# Altium project MOTION_BOARD.PrjPcb (part 1 of 2)
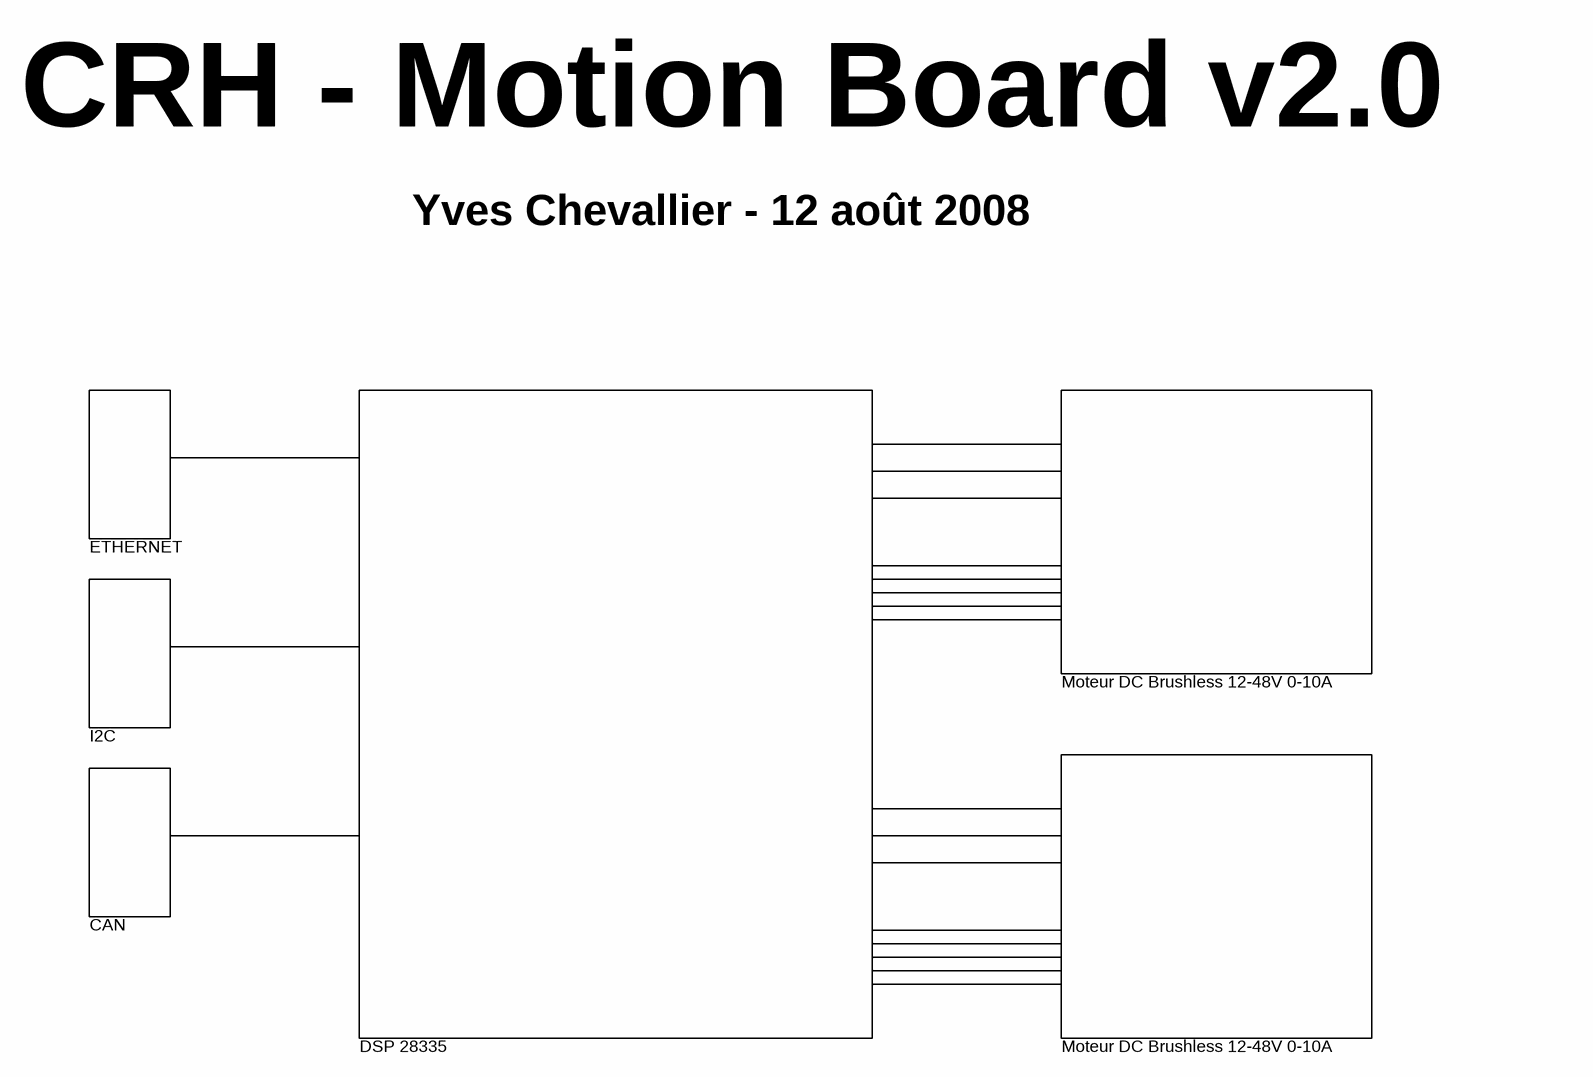
[diagram p0: Title.SchDoc]
Address4: +41 24 557 63 20; Address3: +41 24 557 73 77; Address2: CH-1400 Yverdon-les-Bains; Address1: HEIG-VD; SVN: Yes; ProjectTitle: CRH - MotionBoard
6 sheets, 321 parts. Net scope: hierarchical (ports join the sheet entries above them; power ports are global).
Board file: MOTION_BOARD.PcbDoc
Sheets:
  Title.SchDoc
  PowerSupply.SchDoc
  Interfaces.SchDoc
    DSP = DSP.SchDoc
      Centrale Inertielle = INERTIAL.SchDoc
    H-Bridge3 = PWM.SchDoc
    H-Bridge2 = PWM.SchDoc

## Sheet Title.SchDoc: CRH - Motionboard
size A3; ApprovedBy: Yves Chevallier; CheckedBy: Yves Chevallier; Author: Yves Chevallier; CompanyName: HEIG-VD; DrawnBy: Yves Chevallier; Engineer: Yves Chevallier; Organization: HEIG-VD; Address1: HEIG-VD; Address2: CH-1401 Yverdon-les-Bains; Address3: +41 21 557 73 77; Address4: +41 21 557 63 20; DocumentNumber: ABC.00.0000.000.0; Revision: v2.0; SheetTotal: 0; DrawnByDate: 2008-01-01; ExecutionWarrantDate: 2000-01-01; ExecutionWarrant: Yves Chevallier; Context: Robotique; PageSetup: Record=PageOptions|CenterHorizontal=True|CenterVertical=False|PrintScale=0.97|XCorrection=1.00|YCorrection=1.00|PrintKind=0|BorderSize=5000000|LeftOffset=0|BottomOffset=0|Orientation=2|PaperLength=1000|PaperWidth=1000|Scale=100|PaperSource=262|PrintQuality=600|MediaType=1|DitherType=10|PaperKind=A4|PrintScaleMode=1; EngineerDate: 2008-01-01; CheckedByDate: 2008-01-01; NoProject: 12; ProjectTitle: MotionBoard; SVN: Git; Version: 2.0.0; ProjectName: PRJ

### Notes on the sheet
- CRH - Motion Board v2.0
- Yves Chevallier - 12 août 2008
- ETHERNET
- Moteur DC Brushless 12-48V 0-10A
- I2C
- CAN
- DSP 28335
- HES-SO / HEIG-VD / TIN / IAI
  Route de Cheseaux, 1
  CH-1401 Yverdon-les-Bains
  T +41 24 557 73 77    F +41 24 557 63 20
  http://iai.heig-vd.ch
  iai@heig-vd.ch
- Title
- Size
- Date
- A4
- Project
- Sheet
- of
- No.
- Author
- SVN/Git
- Version
- File

## Sheet PowerSupply.SchDoc: Power Supplies
size A3; ApprovedBy: Yves Chevallier; CheckedBy: Yves Chevallier; Author: Yves Chevallier; CompanyName: HEIG-VD; DrawnBy: Yves Chevallier; Engineer: Yves Chevallier; Organization: HEIG-VD; Address1: HEIG-VD; Address2: CH-1400 Yverdon-les-Bains; Address3: +41 21 557 73 77; Address4: +41 24 557 63 20; DocumentNumber: ABC.00.0000.000.0; Revision: v2.0.0; SheetNumber: 1; SheetTotal: 6; DrawnByDate: 2008-01-01; ExecutionWarrantDate: 2008-01-01; ExecutionWarrant: Yves Chevallier; Context: CRH; PageSetup: Record=PageOptions|CenterHorizontal=True|CenterVertical=False|PrintScale=0.97|XCorrection=1.00|YCorrection=1.00|PrintKind=0|BorderSize=5000000|LeftOffset=0|BottomOffset=0|Orientation=2|PaperLength=1000|PaperWidth=1000|Scale=100|PaperSource=262|PrintQuality=600|MediaType=1|DitherType=10|PaperKind=A4|PrintScaleMode=1; EngineerDate: 2008 -01-01; CheckedByDate: 2008-01-01; ProjectName: PRJ
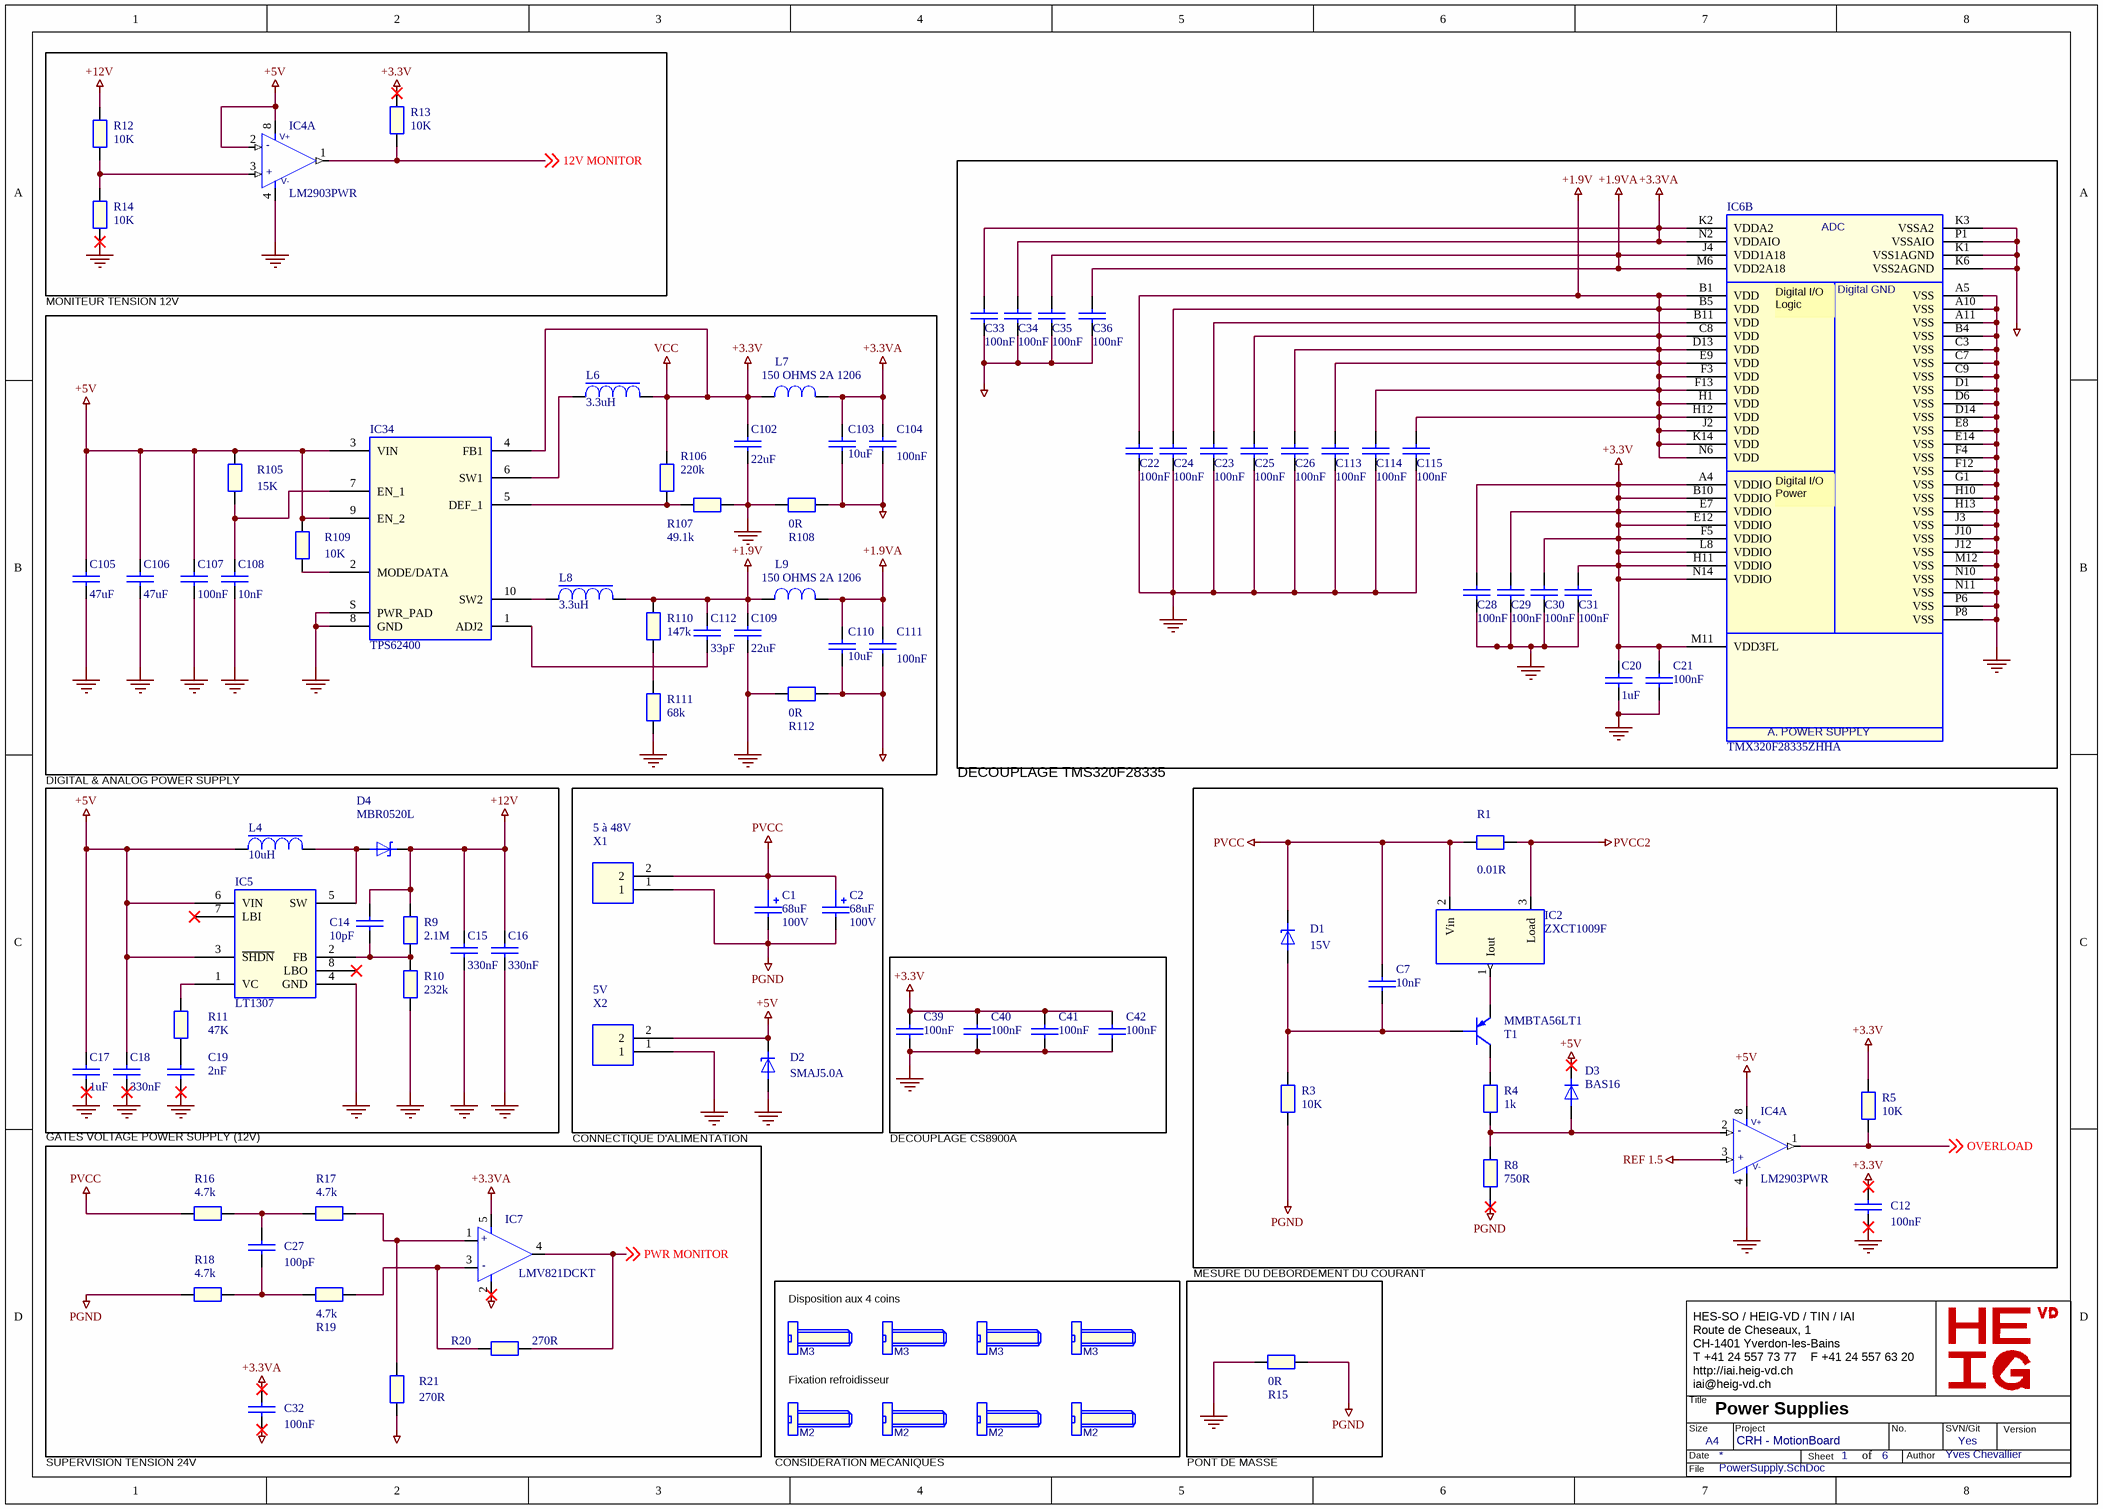
[diagram p1: PowerSupply.SchDoc]

### Parts
(Parts that share a designator on the sheet are numbered #1, #2 ... from top to bottom, then left to right.)
C1  68uF  Voltage: 100V  [SM/C_0805]
C2  68uF  Voltage: 100V  [SM/C_0805]
C7  10nF  [SM/C_0805]
C12  100nF  [SM/C_0805]
C14  10pF  [SM/C_0805]
C15  330nF  [SM/C_0805]
C16  330nF  [SM/C_0805]
C17  1uF  [SM/C_0805]
C18  330nF  [SM/C_0805]
C19  2nF  [SM/C_0805]
C20  1uF  [SM/C_0805]
C21  100nF  [SM/C_0805]
C22  100nF  [SM/C_0805]
C23  100nF  [SM/C_0805]
C24  100nF  [SM/C_0805]
C25  100nF  [SM/C_0805]
C26  100nF  [SM/C_0805]
C27  100pF  [SM/C_0805]
C28  100nF  [SM/C_0805]
C29  100nF  [SM/C_0805]
C30  100nF  [SM/C_0805]
C31  100nF  [SM/C_0805]
C32  100nF  [SM/C_0805]
C33  100nF  [SM/C_0805]
C34  100nF  [SM/C_0805]
C35  100nF  [SM/C_0805]
C36  100nF  [SM/C_0805]
C39  100nF  [SM/C_0805]
C40  100nF  [SM/C_0805]
C41  100nF  [SM/C_0805]
C42  100nF  [SM/C_0805]
C102  22uF  [SM/C_0805]
C103  10uF  [SM/C_0805]
C104  100nF  [SM/C_0805]
C105  47uF  [SM/C_0805]
C106  47uF  [SM/C_0805]
C107  100nF  [SM/C_0805]
C108  10nF  [SM/C_0805]
C109  22uF  [SM/C_0805]
C110  10uF  [SM/C_0805]
C111  100nF  [SM/C_0805]
C112  33pF  [SM/C_0805]
C113  100nF  [SM/C_0805]
C114  100nF  [SM/C_0805]
C115  100nF  [SM/C_0805]
D1  15V  [HEIG/SM/SOT23]
D2  SMAJ5.0A  [SM/DO214AA_12]
D3  BAS16  [HEIG/SM/SOT23]
D4  MBR0520L  [HEIG/SM/SOD123]
H1  M3  [M3]  (value not drawn)
H2  M3  [M3]  (value not drawn)
H3  M3  [M3]  (value not drawn)
H4  M3  [M3]  (value not drawn)
H5  M2  [M3]  (value not drawn)
H6  M2  [M3]  (value not drawn)
H7  M2  [M3]  (value not drawn)
H8  M2  [M3]  (value not drawn)
IC2  ZXCT1009F  [HEIG/SM/SOT23]
IC4#1  LM2903PWR  [HEIG/SM/TSSOP8]  (part A of 2)
IC4#2  LM2903PWR  [HEIG/SM/TSSOP8]  (part A of 2)
IC5  LT1307  [HEIG/SM/SOIC8]
IC6  TMX320F28335ZHHA  [HEIG/BGA/MICROSTAR/S-PBGA-N179]  (part B of 2)
IC7  LMV821DCKT  [HEIG/SM/SC70]
IC34  TPS62400  [HEIG/TI/S-PVSON-N10]
L4  10uH  [HEIG/SM/L_2520]
L6  3.3uH  [HEIG/COILS/VLF4012A]
L7  150 OHMS 2A 1206  [SM/L_1206]
L8  3.3uH  [HEIG/COILS/VLF4012A]
L9  150 OHMS 2A 1206  [SM/L_1206]
R1  0.01R  [R400]
R3  10K  [R400]
R4  1k  [R400]
R5  10K  [R400]
R8  750R  [R400]
R9  2.1M  [SM/R_0805]
R10  232k  [SM/R_0805]
R11  47K  [SM/R_0805]
R12  10K  [R400]
R13  10K  [R400]
R14  10K  [R400]
R15  0R  [SM/R_0805]
R16  4.7k  [R400]
R17  4.7k  [R400]
R18  4.7k  [R400]
R19  4.7k  [R400]
R20  270R  [R400]
R21  270R  [R400]
R105  15K  [SM/R_0805]
R106  220k  [SM/R_0805]
R107  49.1k  [SM/R_0805]
R108  0R  [SM/R_0805]
R109  10K  [SM/R_0805]
R110  147k  [SM/R_0805]
R111  68k  [SM/R_0805]
R112  0R  [SM/R_0805]
T1  MMBTA56LT1  [HEIG/SM/SOT23]
X1  5 à 48V  [HEIG/PHOENIX/MC 2.5/ 2-G-5.08]
X2  5V  [HEIG/PHOENIX/MC 1,5/ 2-G-3,81]

### Blocks framed on the sheet
MONITEUR TENSION 12V: C102-C112 IC34 L6-L9 R105-R112
DIGITAL & ANALOG POWER SUPPLY: C14-C19 D4 IC5 L4 R9-R11
MESURE DU DEBORDEMENT DU COURANT: R15

### Nets
+1.9V: C22.1 C24.1 C25.1 C26.1 C109.1 C112.1 C113.1 C114.1 C115.1 IC6.B1(VDD) IC6.B5(VDD) IC6.C8(VDD) IC6.D13(VDD) IC6.E9(VDD) IC6.F3(VDD) IC6.F13(VDD) IC6.H1(VDD) IC6.H12(VDD) IC6.J2(VDD) IC6.K14(VDD) IC6.N6(VDD) L8.2 L9.1 R110.2
+1.9VA: C35.1 C36.1 C110.1 C111.1 IC6.J4(VDD1A18) IC6.M6(VDD2A18) L9.2
+3.3V: C12.2 C20.1 C21.1 C28.1 C29.1 C30.1 C31.1 C39.1 C40.1 C41.1 C42.1 C102.1 IC6.A4(VDDIO) IC6.B10(VDDIO) IC6.E7(VDDIO) IC6.E12(VDDIO) IC6.F5(VDDIO) IC6.H11(VDDIO) IC6.L8(VDDIO) IC6.M11(VDD3FL) IC6.N14(VDDIO) IC34.4(FB1) L6.2 L7.1 R5.1 R13.1 R106.2  [also labelled VCC]
+3.3VA: C32.2 C33.1 C34.1 C103.1 C104.1 IC6.K2(VDDA2) IC6.N2(VDDAIO) IC7.5(VCC) L7.2
+5V: C17.1 C18.1 C105.1 C106.1 C107.1 D2.1 D3.3(k) IC4#1.2(IN-) IC4#1.8(VCC) IC4#2.8(VCC) IC5.3(~{SHDN}) IC5.6(VIN) IC34.3(VIN) IC34.9(EN_2) L4.1 R105.2 R109.2 X2.2
+12V: C14.1 C15.1 C16.1 D4.2(k) R9.2 R12.1
AGND: C32.1 C33.2 C34.2 C35.2 C36.2 C103.2 C104.2 C110.2 C111.2 IC6.K1(VSS1AGND) IC6.K3(VSSA2) IC6.K6(VSS2AGND) IC6.P1(VSSAIO) IC7.2(GND) R21.1 R108.2 R112.2
GND: C12.1 C15.2 C16.2 C17.2 C18.2 C19.2 C20.2 C21.2 C22.2 C23.2 C24.2 C25.2 C26.2 C28.2 C29.2 C30.2 C31.2 C39.2 C40.2 C41.2 C42.2 C102.2 C105.2 C106.2 C107.2 C108.2 C109.2 C113.2 C114.2 C115.2 D2.2 IC4#1.4(GND) IC4#2.4(GND) IC5.4(GND) IC6.A5(VSS) IC6.A10(VSS) IC6.A11(VSS) IC6.B4(VSS) IC6.C3(VSS) IC6.C7(VSS) IC6.C9(VSS) IC6.D1(VSS) IC6.D6(VSS) IC6.D14(VSS) IC6.E8(VSS) IC6.E14(VSS) IC6.F4(VSS) IC6.F12(VSS) IC6.G1(VSS) IC6.H10(VSS) IC6.H13(VSS) IC6.J3(VSS) IC6.J10(VSS) IC6.J12(VSS) IC6.M12(VSS) IC6.N10(VSS) IC6.N11(VSS) IC6.P6(VSS) IC6.P8(VSS) IC34.8(GND) IC34.S(PWR_PAD) R10.1 R14.2 R15.1 R107.2 R108.1 R111.1 R112.1 X2.1
PGND: C1.2 C2.2 R3.2 R8.2 R15.2 R18.1 X1.1
PVCC: C1.1 C2.1 C7.1 D1.3(k) IC2.2(Vin) R1.1 R16.1 X1.2
PVCC2: IC2.3(Load) R1.2
REF 1.5: IC4#2.3(IN+)
12V MONITOR: IC4#1.1(out) R13.2 ; off-sheet 12V MONITOR
OVERLOAD: IC4#2.1(out) R5.2 ; off-sheet OVERLOAD
PWR MONITOR: IC7.4(out) R20.2 ; off-sheet PWR MONITOR
NetC7_2: C7.2 D1.1(a) R3.1 T1.1(B)
NetC14_2: C14.2 IC5.2(FB) R9.1 R10.2
NetC19_1: C19.1 R11.1
NetC23_1: C23.1 IC6.B11(VDD)
NetC27_1: C27.1 R18.2 R19.1
NetC27_2: C27.2 R16.2 R17.1
NetC108_1: C108.1 IC34.7(EN_1) R105.1
NetC112_2: C112.2 IC34.1(ADJ2)
NetD3_1: D3.1(a) IC4#2.2(IN-) R4.2 R8.1
NetD4_1: D4.1(a) IC5.5(SW) L4.2
NetIC2_1: IC2.1(Iout) T1.2(E)
NetIC4#1_3: IC4#1.3(IN+) R12.2 R14.1
NetIC5_1: IC5.1(VC) R11.2
NetIC7_1: IC7.1(IN+) R17.2 R21.2
NetIC7_3: IC7.3(IN-) R19.2 R20.1
NetIC34_2: IC34.2(MODE/DATA) R109.1
NetIC34_5: IC34.5(DEF_1) R106.1 R107.1
NetIC34_6: IC34.6(SW1) L6.1
NetIC34_10: IC34.10(SW2) L8.1
NetR4_1: R4.1 T1.3(C)
NetR110_1: R110.1 R111.2

Not connected (* = marked no-connect by the designer): H1 1(EARTH); H2 1(EARTH); H3 1(EARTH); H4 1(EARTH); H5 1(EARTH); H6 1(EARTH); H7 1(EARTH); H8 1(EARTH); IC5 7(LBI)* 8(LBO)*

### Notes on the sheet
- DECOUPLAGE TMS320F28335
- GATES VOLTAGE POWER SUPPLY (12V)
- CONNECTIQUE D'ALIMENTATION
- DECOUPLAGE CS8900A
- Disposition aux 4 coins
- Fixation refroidisseur
- SUPERVISION TENSION 24V
- CONSIDERATION MECANIQUES
- PONT DE MASSE
- HES-SO / HEIG-VD / TIN / IAI
  Route de Cheseaux, 1
  CH-1401 Yverdon-les-Bains
  T +41 24 557 73 77    F +41 24 557 63 20
  http://iai.heig-vd.ch
  iai@heig-vd.ch
- Title
- Size
- Date
- A4
- Project
- Sheet
- of
- No.
- Author
- SVN/Git
- Version
- File
- (in symbol LM2903, part A) V+; -; +; V-
- (in symbol LMV821DCKT_0) +; -
- (in symbol TMS320F2833xZHH, part B) ADC; Digital GND; Digital I/O / Logic; Digital I/O / Power; A. POWER SUPPLY

### Library data of the parts
C1 C2 = C+: Quantité min: 1; Fabricant: PANASONIC; Prix: 2.80; Ref. Fabricant: EEVFK2A680Q; Ref. Fab: ECA1CM471.PANASONIC; PCB Footprint: HEIG/SM/CT_H13; Ref. Distributeur: 9696156; Distributeur: Farnell; Price in €: 0.20; Ref. Distributor: 320-1508; Distributor: Farnell
C7 = C: Quantité min: 5; Prix: 0.16; Ref. Fabricant: 06031C103K4Z2A; Fabricant: AVX; Tolerance: 5%; Voltage: 50V; PCB Footprint: HEIG/SM/C_0603; Distributeur: Farnell; Ref. Distributeur: 1301715; Price: 0.07; Price in €: 0.07
C12 = C: Quantité min: 10; Ref. Fabricant: 2238 786 15649; Fabricant: PHYCOMP; Prix: 0.113; Voltage: 16V; Tolerance: 10%; PCB Footprint: HEIG/SM/C_0603; Ref. Distributeur: 432210; Distributeur: Farnell; Price: 0.04
C14 = C_Dup1: Ref. Fabricant: 06035A100JAT2A; Prix: 0.066; Ref. Fab: AVXMCCTA106M006.MULTICOMP; VOLTAGE: 10V; Référence: 757-720; Prix Unitaire: 0.40; Fabricant: AVX; Quantité min: 10; PCB Footprint: HEIG/SM/C_0603; Ref. Distributeur: 499110; Distributeur: Farnell; Price in €: 0.87; Ref. Distributor: 967-014; Distributor: Farnell
C15 C16 = C_Dup1: Ref. Fabricant: B37941K0334K60; Prix: 0.123; Ref. Fab: AVXMCCTA106M006.MULTICOMP; VOLTAGE: 25V; Référence: 757-720; Prix Unitaire: 0.40; Fabricant: EPCOS; Quantité min: 10; Tolérance: 10%; Ref. Distributeur: 8805660; Distributeur: Farnell; Price in €: 0.87; Ref. Distributor: 967-014; Distributor: Farnell; PCB Footprint: SM/C_0805
C17 C20 = C_Dup1: Prix Unitaire: 0.40; Référence: 757-720; VOLTAGE: 10V; Ref. Fab: AVXMCCTA106M006.MULTICOMP; Prix: 0.221; Ref. Fabricant: 06036D105KAT2A; Fabricant: AVX; Quantité min: 10; Tolérance: 10%; PCB Footprint: HEIG/SM/C_0603; Distributor: Farnell; Ref. Distributor: 967-014; Price in €: 0.87; Distributeur: Farnell; Ref. Distributeur: 1327676
C18 = C_Dup1: Ref. Fabricant: 0603YD334KAT2A; Prix: 0.382; Ref. Fab: AVXMCCTA106M006.MULTICOMP; VOLTAGE: 16V; Référence: 757-720; Prix Unitaire: 0.40; Fabricant: MULTICOMP; Tolérance: 10%; Quantité min: 10; PCB Footprint: HEIG/SM/C_0603; Ref. Distributeur: 1327681; Distributeur: Farnell; Price in €: 0.87; Ref. Distributor: 967-014; Distributor: Farnell
C19 = C_Dup1: Ref. Fabricant: 06035C222KAT2A; Prix: 0.098; Ref. Fab: AVXMCCTA106M006.MULTICOMP; VOLTAGE: 10V; Référence: 757-720; Prix Unitaire: 0.40; Fabricant: AVX; Quantité min: 10; Tolérance: 10%; PCB Footprint: HEIG/SM/C_0603; Ref. Distributeur: 498592; Distributeur: Farnell; Price in €: 0.87; Ref. Distributor: 967-014; Distributor: Farnell
C21 = C_Dup1: Quantité min: 10; Fabricant: PHYCOMP; Ref. Fabricant: 2238 786 15649; Prix: 0.113; Ref. Fab: AVX; Voltage: 16V; PCB Footprint: HEIG/SM/C_0603; Distributeur: Farnell; Ref. Distributeur: 432210; Distributor: Farnell; Price in €: 0.140; Ref. Distributor: 499-687
C22 C23 C25 C26 C33 C113-C115 = C_Dup1: Référence: 499-687; Prix Unitaire: 0.14; Ref. Fab: AVX; Prix: 0.113; Ref. Fabricant: 2238 786 15649; Fabricant: PHYCOMP; Quantité min: 10; Voltage: 16V; PCB Footprint: HEIG/SM/C_0402; Distributor: Farnell; Ref. Distributor: 499-687; Price in €: 0.140; Distributeur: Farnell
C24 = C_Dup1: Voltage: 16V; Ref. Fabricant: 2238 786 15649; Prix: 0.113; Ref. Fab: AVX; Prix Unitaire: 0.14; Référence: 499-687; Fabricant: PHYCOMP; Quantité min: 10; PCB Footprint: HEIG/SM/C_0402; Distributeur: Farnell; Price in €: 0.140; Ref. Distributor: 499-687; Distributor: Farnell
C27 = C_Dup1: Quantité min: 10; Fabricant: MURATA; Ref. Fab: AVX; Prix Unitaire: 0.14; Référence: 499-687; Prix: 0.071; Ref. Fabricant: GRM1885C1H101JA01D; PCB Footprint: HEIG/SM/C_0603; Price in €: 0.140; Ref. Distributor: 499-687; Distributor: Farnell; Distributeur: Farnell; Ref. Distributeur: 8819866
C28 = C_Dup1: Voltage: 16V; Quantité min: 10; Fabricant: PHYCOMP; Ref. Fabricant: 2238 786 15649; Prix: 0.113; Ref. Fab: AVX; Référence: 499-687; Prix Unitaire: 0.14; PCB Footprint: HEIG/SM/C_0402; Distributeur: Farnell; Price in €: 0.140; Ref. Distributor: 499-687; Distributor: Farnell
C29 C30 = C_Dup1: Prix Unitaire: 0.14; Référence: 499-687; Ref. Fab: AVX; Prix: 0.113; Ref. Fabricant: 2238 786 15649; Fabricant: PHYCOMP; Quantité min: 10; Voltage: 16V; PCB Footprint: HEIG/SM/C_0402; Distributor: Farnell; Ref. Distributor: 499-687; Price in €: 0.140; Distributeur: Farnell
C31 = C_Dup1: Quantité min: 10; Fabricant: PHYCOMP; Ref. Fabricant: 2238 786 15649; Prix: 0.113; Ref. Fab: AVX; Référence: 499-687; Prix Unitaire: 0.14; Voltage: 16V; PCB Footprint: HEIG/SM/C_0402; Distributeur: Farnell; Price in €: 0.140; Ref. Distributor: 499-687; Distributor: Farnell
C32 = C_Dup1: Voltage: 16V; Quantité min: 10; Fabricant: PHYCOMP; Ref. Fabricant: 2238 786 15649; Prix: 0.113; Référence: 499-687; Prix Unitaire: 0.14; Ref. Fab: AVX; PCB Footprint: HEIG/SM/C_0603; Ref. Distributeur: 432210; Distributeur: Farnell; Distributor: Farnell; Ref. Distributor: 499-687; Price in €: 0.140
C34 = C_Dup1: Voltage: 16V; Quantité min: 10; Fabricant: PHYCOMP; Ref. Fabricant: 2238 786 15649; Prix: 0.113; Ref. Fab: AVX; Prix Unitaire: 0.14; Référence: 499-687; PCB Footprint: HEIG/SM/C_0402; Distributeur: Farnell; Price in €: 0.140; Ref. Distributor: 499-687; Distributor: Farnell
C35 = C_Dup1: Ref. Fab: AVX; Prix Unitaire: 0.14; Référence: 499-687; Prix: 0.113; Ref. Fabricant: 2238 786 15649; Fabricant: PHYCOMP; Quantité min: 10; Voltage: 16V; PCB Footprint: HEIG/SM/C_0402; Price in €: 0.140; Ref. Distributor: 499-687; Distributor: Farnell; Distributeur: Farnell
C36 = C_Dup1: Voltage: 16V; Quantité min: 10; Fabricant: PHYCOMP; Ref. Fabricant: 2238 786 15649; Prix: 0.113; Référence: 499-687; Prix Unitaire: 0.14; Ref. Fab: AVX; PCB Footprint: HEIG/SM/C_0402; Distributeur: Farnell; Distributor: Farnell; Ref. Distributor: 499-687; Price in €: 0.140
C39 C40 = C_Dup1: PCB Footprint: HEIG/SM/C_0603; Voltage: 16V; Quantité min: 10; Fabricant: PHYCOMP; Ref. Fabricant: 2238 786 15649; Prix: 0.113; Ref. Fab: AVX; Référence: 499-687; Prix Unitaire: 0.14; Ref. Distributeur: 432210; Distributeur: Farnell; Price in €: 0.140; Ref. Distributor: 499-687; Distributor: Farnell
C41 C42 = C_Dup1: PCB Footprint: HEIG/SM/C_0603; Voltage: 16V; Prix Unitaire: 0.14; Référence: 499-687; Ref. Fab: AVX; Prix: 0.113; Ref. Fabricant: 2238 786 15649; Fabricant: PHYCOMP; Quantité min: 10; Distributor: Farnell; Ref. Distributor: 499-687; Price in €: 0.140; Distributeur: Farnell; Ref. Distributeur: 432210
C102 = C_Dup1: PCB Footprint: HEIG/SM/C_1206; Ref. Fabricant: C1206C226K9PAC; Prix: 1.15; Prix Unitaire: 0.40; Référence: 757-720; VOLTAGE: 6.3V; Ref. Fab: AVXMCCTA106M006.MULTICOMP; Fabricant: AVX; Quantité min: 1; Distributeur: Farnell; Ref. Distributeur: 1288265; Distributor: Farnell; Ref. Distributor: 967-014; Price in €: 0.87
C103 = C_Dup1: PCB Footprint: HEIG/SM/C_0805; Ref. Fabricant: C0805C106K9PAC; Prix: 0.55; Ref. Fab: AVXMCCTA106M006.MULTICOMP; VOLTAGE: 6.3V; Référence: 757-720; Prix Unitaire: 0.40; Fabricant: KEMET; Quantité min: 10; Ref. Distributeur: 9227814; Distributeur: Farnell; Price in €: 0.87; Ref. Distributor: 967-014; Distributor: Farnell
C104 C111 = C_Dup1: Quantité min: 10; Voltage: 16V; Fabricant: PHYCOMP; Ref. Fabricant: 2238 786 15649; Prix: 0.113; Référence: 499-687; Prix Unitaire: 0.14; Ref. Fab: AVX; PCB Footprint: HEIG/SM/C_0603; Ref. Distributeur: 432210; Distributeur: Farnell; Distributor: Farnell; Ref. Distributor: 499-687; Price in €: 0.140
C105 C106 = C_Dup1: PCB Footprint: HEIG/SM/C_1206; Prix Unitaire: 0.40; Référence: 757-720; VOLTAGE: 6.3V; Ref. Fab: AVXMCCTA106M006.MULTICOMP; Prix: 8.20; Ref. Fabricant: 12106D476MAT2A; Fabricant: AVX; Quantité min: 1; Distributor: Farnell; Ref. Distributor: 967-014; Price in €: 0.87; Distributeur: Farnell; Ref. Distributeur: 1327743
C107 C108 C112 = C_Dup1: PCB Footprint: HEIG/SM/C_0603; Prix Unitaire: 0.40; Référence: 757-720; VOLTAGE: 10V; Ref. Fab: AVXMCCTA106M006.MULTICOMP; Quantité min: 1; Distributor: Farnell; Ref. Distributor: 967-014; Price in €: 0.87; Distributeur: Farnell
C109 = C_Dup1: PCB Footprint: HEIG/SM/C_1206; Prix Unitaire: 0.40; Référence: 757-720; VOLTAGE: 6.3V; Ref. Fab: AVXMCCTA106M006.MULTICOMP; Prix: 1.15; Ref. Fabricant: C1206C226K9PAC; Fabricant: AVX; Quantité min: 1; Distributor: Farnell; Ref. Distributor: 967-014; Price in €: 0.87; Distributeur: Farnell; Ref. Distributeur: 1288265
C110 = C_Dup1: PCB Footprint: HEIG/SM/C_0805; Ref. Fab: AVXMCCTA106M006.MULTICOMP; VOLTAGE: 6.3V; Référence: 757-720; Prix Unitaire: 0.40; Prix: 0.55; Ref. Fabricant: C0805C106K9PAC; Fabricant: KEMET; Quantité min: 10; Price in €: 0.87; Ref. Distributor: 967-014; Distributor: Farnell; Distributeur: Farnell; Ref. Distributeur: 9227814
D1 = D Zener_1: Fabricant: MULTICOMP; Ref. Fabricant: BZX84C15; Prix: 0.167; Quantité min: 5; Price: 0.19; Distributeur: Farnell; Ref. Distributeur: 1466585; Voltage: BZX84C15; PCB Footprint: HEIG/SM/SOT23
D2 = D Zener_0: Quantité min: 1; Fabricant: VISHAY GENERAL SEMICONDUCTOR; Prix: 0.989; Distributeur: Farnell; Ref. Distributeur: 9550941; Ref. Fabricant: SMAJ5.0A; Distributor: Farnell; PCB Footprint: SM/DO214AA_12
D3 = D_0: Fabricant: NXP; Prix: 0.196; Quantité min: 10; Price: 0.19; Ref. Distributeur: 1081180; Distributeur: Farnell; Ref. Fabricant: BAS16; PCB Footprint: HEIG/SM/SOT23
D4 = D Schottky: Quantité min: 1; Prix: 0.12; Fabricant: FAIRCHILD SEMICONDUCTOR; Ref. Fabricant: MBR0520L; Ref. Distributeur: 1467521; Distributeur: Farnell; PCB Footprint: HEIG/SM/SOD123
H1-H4 = M3: PCB Footprint: HEIG/HOLE/M3
H5-H8 = M3_0: PCB Footprint: HEIG/HOLE/M2; Price in €: 0.60; Ref. Distributor: 34 11 30; Distributor: Distrelec; Ref. Fab: -
IC2 = ZXCT1009: Quantité min: 1; Prix: 2.90; Fabricant: ZETEX; Ref. Fabricant: ZXCT1009F; Distributeur: Farnell; Ref. Distributeur: 1132757; Price: 2.3; PCB Footprint: HEIG/SM/SOT23
IC4#1 IC4#2 = LM2903: Quantité min: 1; Prix: 0.554; Fabricant: TEXAS INSTRUMENTS; Ref. Fabricant: LM2903PWR; Distributeur: Farnell; Ref. Distributeur: 8389209; Price: 0.56; PCB Footprint: HEIG/SM/TSSOP8
IC5 = LT1307: Ref. Fabricant: LT1307BCS8#PBF; Prix: 8.70; Quantité min: 1; Fabricant: LINEAR TECHNOLOGY; Distributeur: Farnell; Ref. Distributeur: 1273725; PCB Footprint: HEIG/SM/SOIC8
IC6 = TMS320F2833xZHH: Fabricant: TEXAS INSTRUMENTS; Prix: 94.45; Quantité min: 1; Distributeur: Farnell; Ref. Distributeur: 1503814; Ref. Fabricant: TMX320F28335ZHHA; PCB Footprint: HEIG/BGA/MICROSTAR/S-PBGA-N179
IC7 = LMV821DCKT_0: Quantité min: 1; Fabricant: TEXAS INSTRUMENTS; Prix: 1.45; Ref. Fabricant: LMV821IDCKTE4; PCB Footprint: HEIG/SM/SC70; Distributor: Spoerle; Ref. Fab: LMV821DCKT; Ref. Distributor: LMV821DCKT; Price in €: 0.7; Ref. Distributeur: 1053752; Distributeur: Farnell
IC34 = TPS62400_1: PCB Footprint: HEIG/TI/S-PVSON-N10
L4 = L Noyau: Ref. Fabricant: ELJFC100JF; Prix: 1; Quantité min: 5; Tolérance: 5%; Fabricant: PANASONIC; Distributeur: Farnell; Ref. Distributeur: 1198424; PCB Footprint: HEIG/SM/L_2520
L6 L8 = L Noyau: Quantité min: 1; Fabricant: TDK; Ref. Fabricant: VLF4012AT-3R3M1R3; Prix: 3.90; PCB Footprint: HEIG/COILS/VLF4012A; Distributeur: Farnell; Ref. Distributeur: 1301686
L7 = L Symbole 3 spires: Ref. Fab: epocs; Prix: 0.552; Ref. Fabricant: MLB-321611-0150PN; Fabricant: KITAGAWA; Quantité min: 10; Distributor: Farnell; Price in €: 0.98; Ref. Distributor: 200-610; Ref. Distributeur: 1308791; Distributeur: Farnell; PCB Footprint: SM/L_1206
L9 = L Symbole 3 spires: Quantité min: 10; Fabricant: KITAGAWA; Ref. Fabricant: MLB-321611-0150PN; Prix: 0.552; Ref. Fab: epocs; Distributeur: Farnell; Ref. Distributeur: 1308791; Distributor: Farnell; Price in €: 0.98; Ref. Distributor: 200-610; PCB Footprint: SM/L_1206
R1 = R_Dup1: Quantité min: 5; Fabricant: VISHAY DALE; Ref. Fabricant: WSR-5 .01 1% EA E2; Prix: 4.20; PCB Footprint: WSR-5; Distributeur: Farnell; Ref. Distributeur: 1107476
R3 = R_Dup1: Quantité min: 50; Ref. Fabricant: 232270260103; Fabricant: PHYCOMP; Prix: 0.113; Tolerance: 5%; Power: 0.063W; PCB Footprint: HEIG/SM/R_0603; Ref. Distributeur: 9233504; Distributeur: Farnell; Price: 0.06
R4 = R_Dup1: Quantité min: 50; Ref. Fabricant: 232270260102; Fabricant: PHYCOMP; Prix: 0.113; Tolerance: 1%; Power: 0.063W; PCB Footprint: HEIG/SM/R_0603; Ref. Distributeur: 9233385; Distributeur: Farnell; Price: 0.06
R5 = R_Dup1: Quantité min: 50; Ref. Fabricant: 232270260103; Fabricant: PHYCOMP; Prix: 0.113; Power: 0.063W; Tolerance: 5%; PCB Footprint: HEIG/SM/R_0603; Ref. Distributeur: 9233504; Distributeur: Farnell; Price: 0.06
R8 = R_Dup1: Quantité min: 50; Ref. Fabricant: MC 0.063W 0603 1% 750R; Fabricant: MULTICOMP; Prix: 0.064; Tolerance: 1%; Power: 0.063W; PCB Footprint: HEIG/SM/R_0603; Ref. Distributeur: 9331506; Distributeur: Farnell; Price: 0.06
R9 = R SMD 0805N: Prix: 0.01; Ref. Fabricant: CRCW06032M10FKEA; Fabricant: VISHAY DALE; Quantité min: 10; PCB Footprint: HEIG/SM/R_0603; Package: SMD 0805N; Ref. Distributeur: 1570725; Distributeur: Farnell
R10 = R SMD 0805N: Ref. Fabricant: CPF0603F232KC1; Prix: 0.79; Fabricant: TYCO ELECTRONICS; Quantité min: 5; Tolérance: 1%; PCB Footprint: HEIG/SM/R_0603; Package: SMD 0805N; Distributeur: Farnell; Ref. Distributeur: 1527729
R11 = R SMD 0805N: Prix: 0.056; Ref. Fabricant: 232270260473; Fabricant: PHYCOMP; Quantité min: 50; PCB Footprint: HEIG/SM/R_0603; Package: SMD 0805N; Ref. Distributeur: 9233580; Distributeur: Farnell
R12 = R_Dup1: Quantité min: 50; Ref. Fabricant: 232270260103; Fabricant: PHYCOMP; Prix: 0.113; Tolerance: 1%; Power: 0.063W; PCB Footprint: HEIG/SM/R_0603; Ref. Distributeur: 9233504; Distributeur: Farnell; Price: 0.06
R13 = R_Dup1: Quantité min: 50; Prix: 0.113; Ref. Fabricant: 232270260103; Fabricant: PHYCOMP; Power: 0.063W; Tolerance: 5%; PCB Footprint: HEIG/SM/R_0603; Distributeur: Farnell; Ref. Distributeur: 9233504; Price: 0.06
R14 = R_Dup1: Quantité min: 50; Prix: 0.113; Ref. Fabricant: 232270260103; Fabricant: PHYCOMP; Tolerance: 1%; Power: 0.063W; PCB Footprint: HEIG/SM/R_0603; Ref. Distributeur: 9233504; Distributeur: Farnell; Price: 0.06
R15 = R SMD 0805N: Quantité min: 50; Fabricant: MULTICOMP; Ref. Fabricant: MC 0.125W 1206 0R; Prix: 0.064; PCB Footprint: SM/R_1206; Package: SMD 0805N; Distributeur: Farnell; Ref. Distributeur: 9336974
R16-R19 = R_Dup1: Quantité min: 50; Fabricant: MULTICOMP; Prix: 0.064; Ref. Fabricant: MC 0.063W 0603 5% 4K7; PCB Footprint: HEIG/SM/R_0603; Distributeur: Farnell; Ref. Distributeur: 9332154
R20 R21 = R_Dup1: Prix: 0.064; Ref. Fabricant: MC 0.063W 0603 5% 270R; Fabricant: MULTICOMP; Quantité min: 50; PCB Footprint: HEIG/SM/R_0603; Distributeur: Farnell
R105 = R SMD 0805N: PCB Footprint: SM/R_0603; Prix: 0.064; Quantité min: 50; Package: SMD 0805N; Distributeur: Farnell
R106 R107 = R SMD 0805N: PCB Footprint: SM/R_0603; Quantité min: 50; Prix: 0.064; Package: SMD 0805N; Distributeur: Farnell
R108 = R SMD 0805N: Quantité min: 50; Fabricant: MULTICOMP; Prix: 0.064; Package: SMD 0805N; PCB Footprint: SM/R_0805; Distributeur: Farnell
R109 = R SMD 0805N: Prix: 0.064; Quantité min: 50; PCB Footprint: SM/R_0603; Package: SMD 0805N; Distributeur: Farnell
R110 = R SMD 0805N: PCB Footprint: SM/R_0603; Prix: 0.064; Ref. Fabricant: MC 0.063W 0603 1% 147K; Fabricant: MULTICOMP; Quantité min: 50; Package: SMD 0805N; Distributeur: Farnell; Ref. Distributeur: 1171002
R111 = R SMD 0805N: PCB Footprint: SM/R_0603; Prix: 0.064; Ref. Fabricant: MC 0.063W 0603 5% 68K; Fabricant: MULTICOMP; Quantité min: 50; Package: SMD 0805N; Distributeur: Farnell; Ref. Distributeur: 9332278
R112 = R SMD 0805N: Prix: 0.064; Fabricant: MULTICOMP; Quantité min: 50; Package: SMD 0805N; PCB Footprint: SM/R_0805; Distributeur: Farnell
T1 = MMBTA56LT1: Quantité min: 5; Prix: 0.182; Ref. Fabricant: MMBTA56LT1G; Fabricant: ON SEMICONDUCTOR; Ref. Distributeur: 9555900; Distributeur: Farnell; Price: 0.16; PCB Footprint: HEIG/SM/SOT23
X1 = Connecteur 02: Fabricant: PHOENIX CONTACT; Ref. Fabricant: 3705171; Prix: 0.882; Ref. Distributeur: 3705171; Distributeur: Farnell; PCB Footprint: HEIG/PHOENIX/MC 2.5/ 2-G-5.08
X2 = Connecteur 02: Quantité min: 1; Fabricant: PHOENIX CONTACT; Prix: 0.931; Ref. Fabricant: 1803277; Distributeur: Farnell; Ref. Distributeur: 3704725; PCB Footprint: HEIG/PHOENIX/MC 1,5/ 2-G-3,81

## Sheet Interfaces.SchDoc: Interfaces
size A2; ApprovedBy: Yves Chevallier; CheckedBy: Yves Chevallier; Author: Yves Chevallier; CompanyName: HEIG-VD; DrawnBy: Yves Chevallier; Engineer: Yves Chevallier; Organization: HEIG-VD; Address1: HEIG-VD; Address2: CH1015 Lausanne; Address3: +41(0)21 693 36 98; Address4: +41(0)21 693 26 00; DocumentNumber: ABC.00.0000.000.0; Revision: v1.0; SheetNumber: 0; SheetTotal: 0; DrawnByDate: 2000-01-01; ExecutionWarrantDate: 2000-01-01; ExecutionWarrant: Yves Chevallier; Context: Confidential; PageSetup: Record=PageOptions|CenterHorizontal=True|CenterVertical=False|PrintScale=0.97|XCorrection=1.00|YCorrection=1.00|PrintKind=0|BorderSize=5000000|LeftOffset=0|BottomOffset=0|Orientation=2|PaperLength=1000|PaperWidth=1000|Scale=100|PaperSource=262|PrintQuality=600|MediaType=1|DitherType=10|PaperKind=A4|PrintScaleMode=1; EngineerDate: 2000-01-01; CheckedByDate: 2000-01-01; ProjectName: PRJ
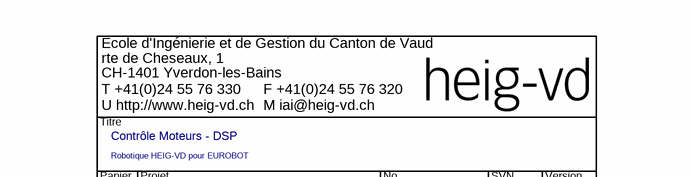
[diagram p2: Interfaces.SchDoc, top right]
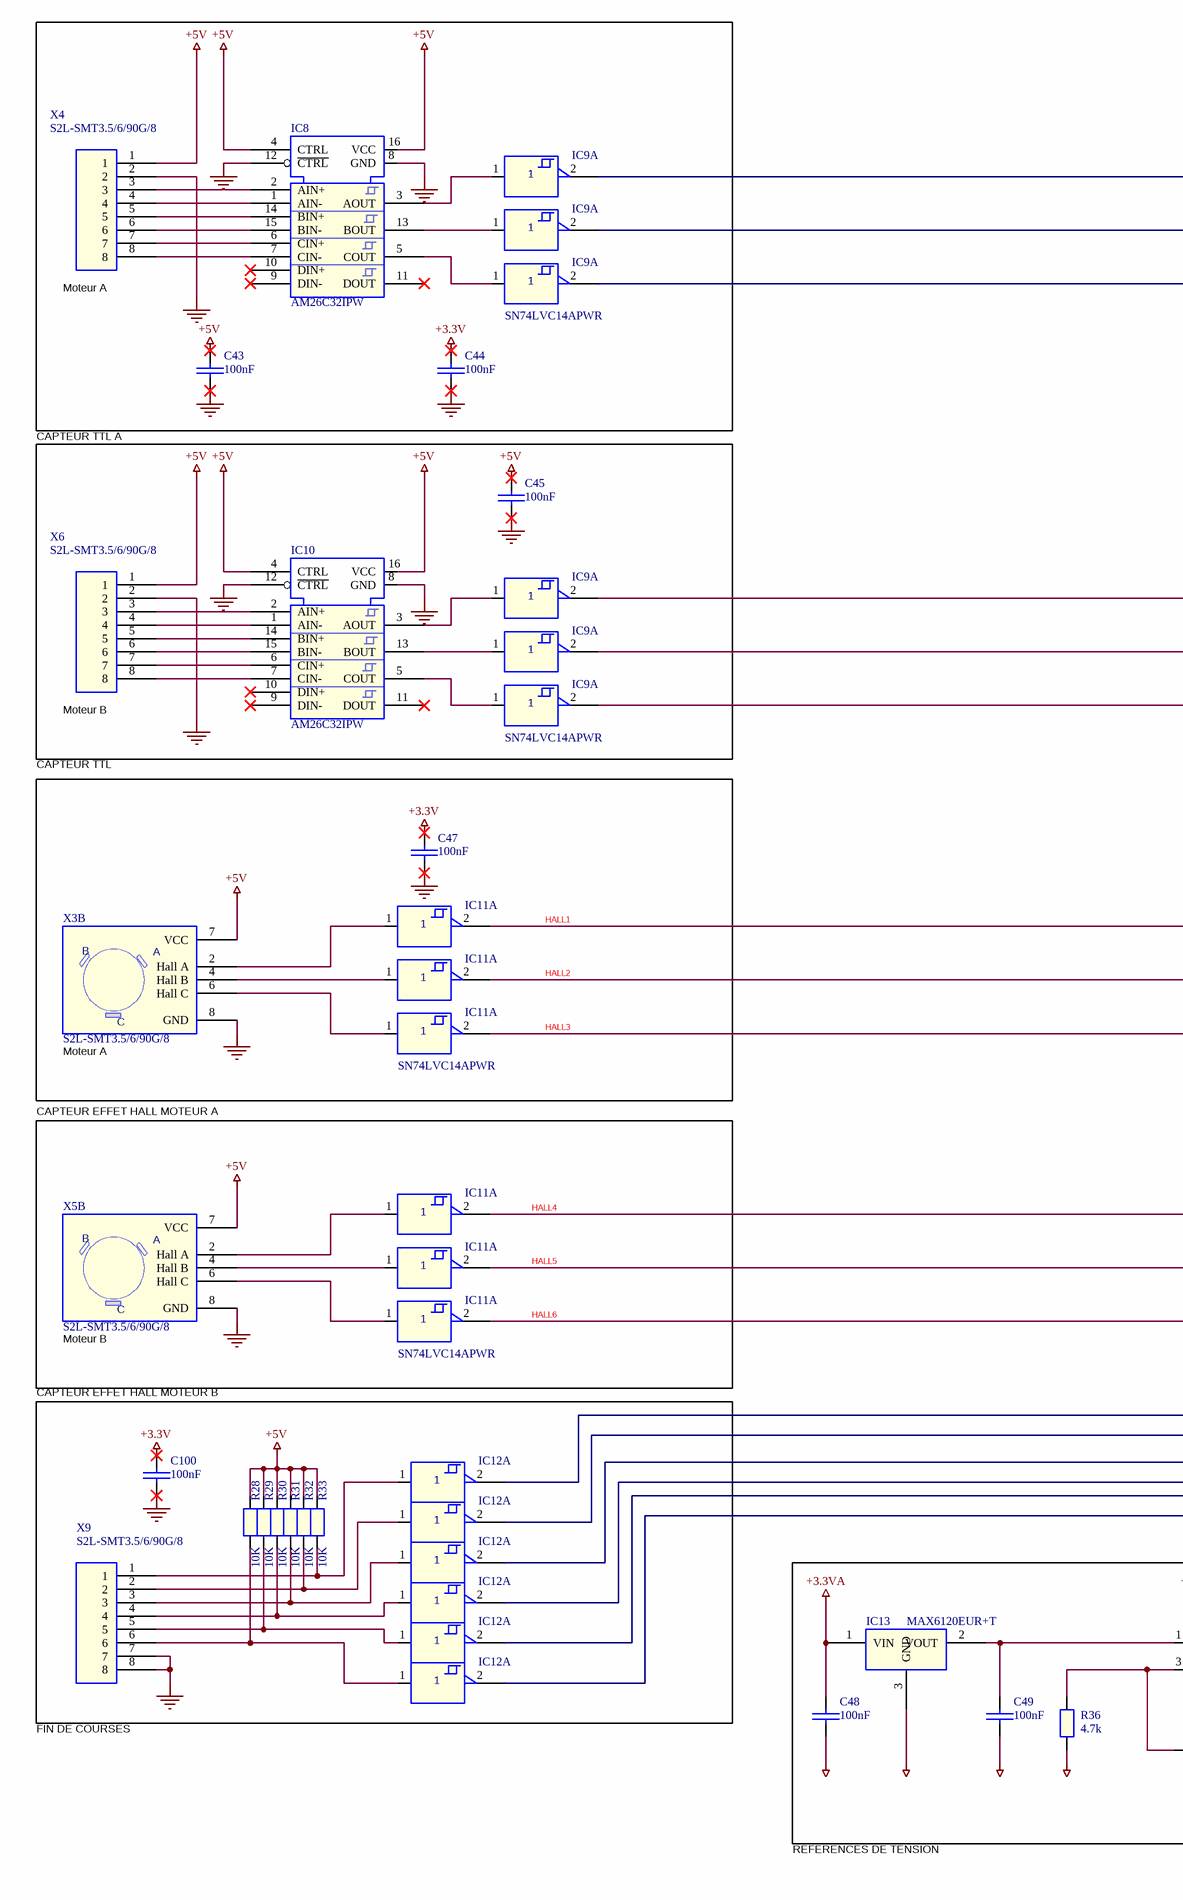
[diagram p3: Interfaces.SchDoc, bottom left]
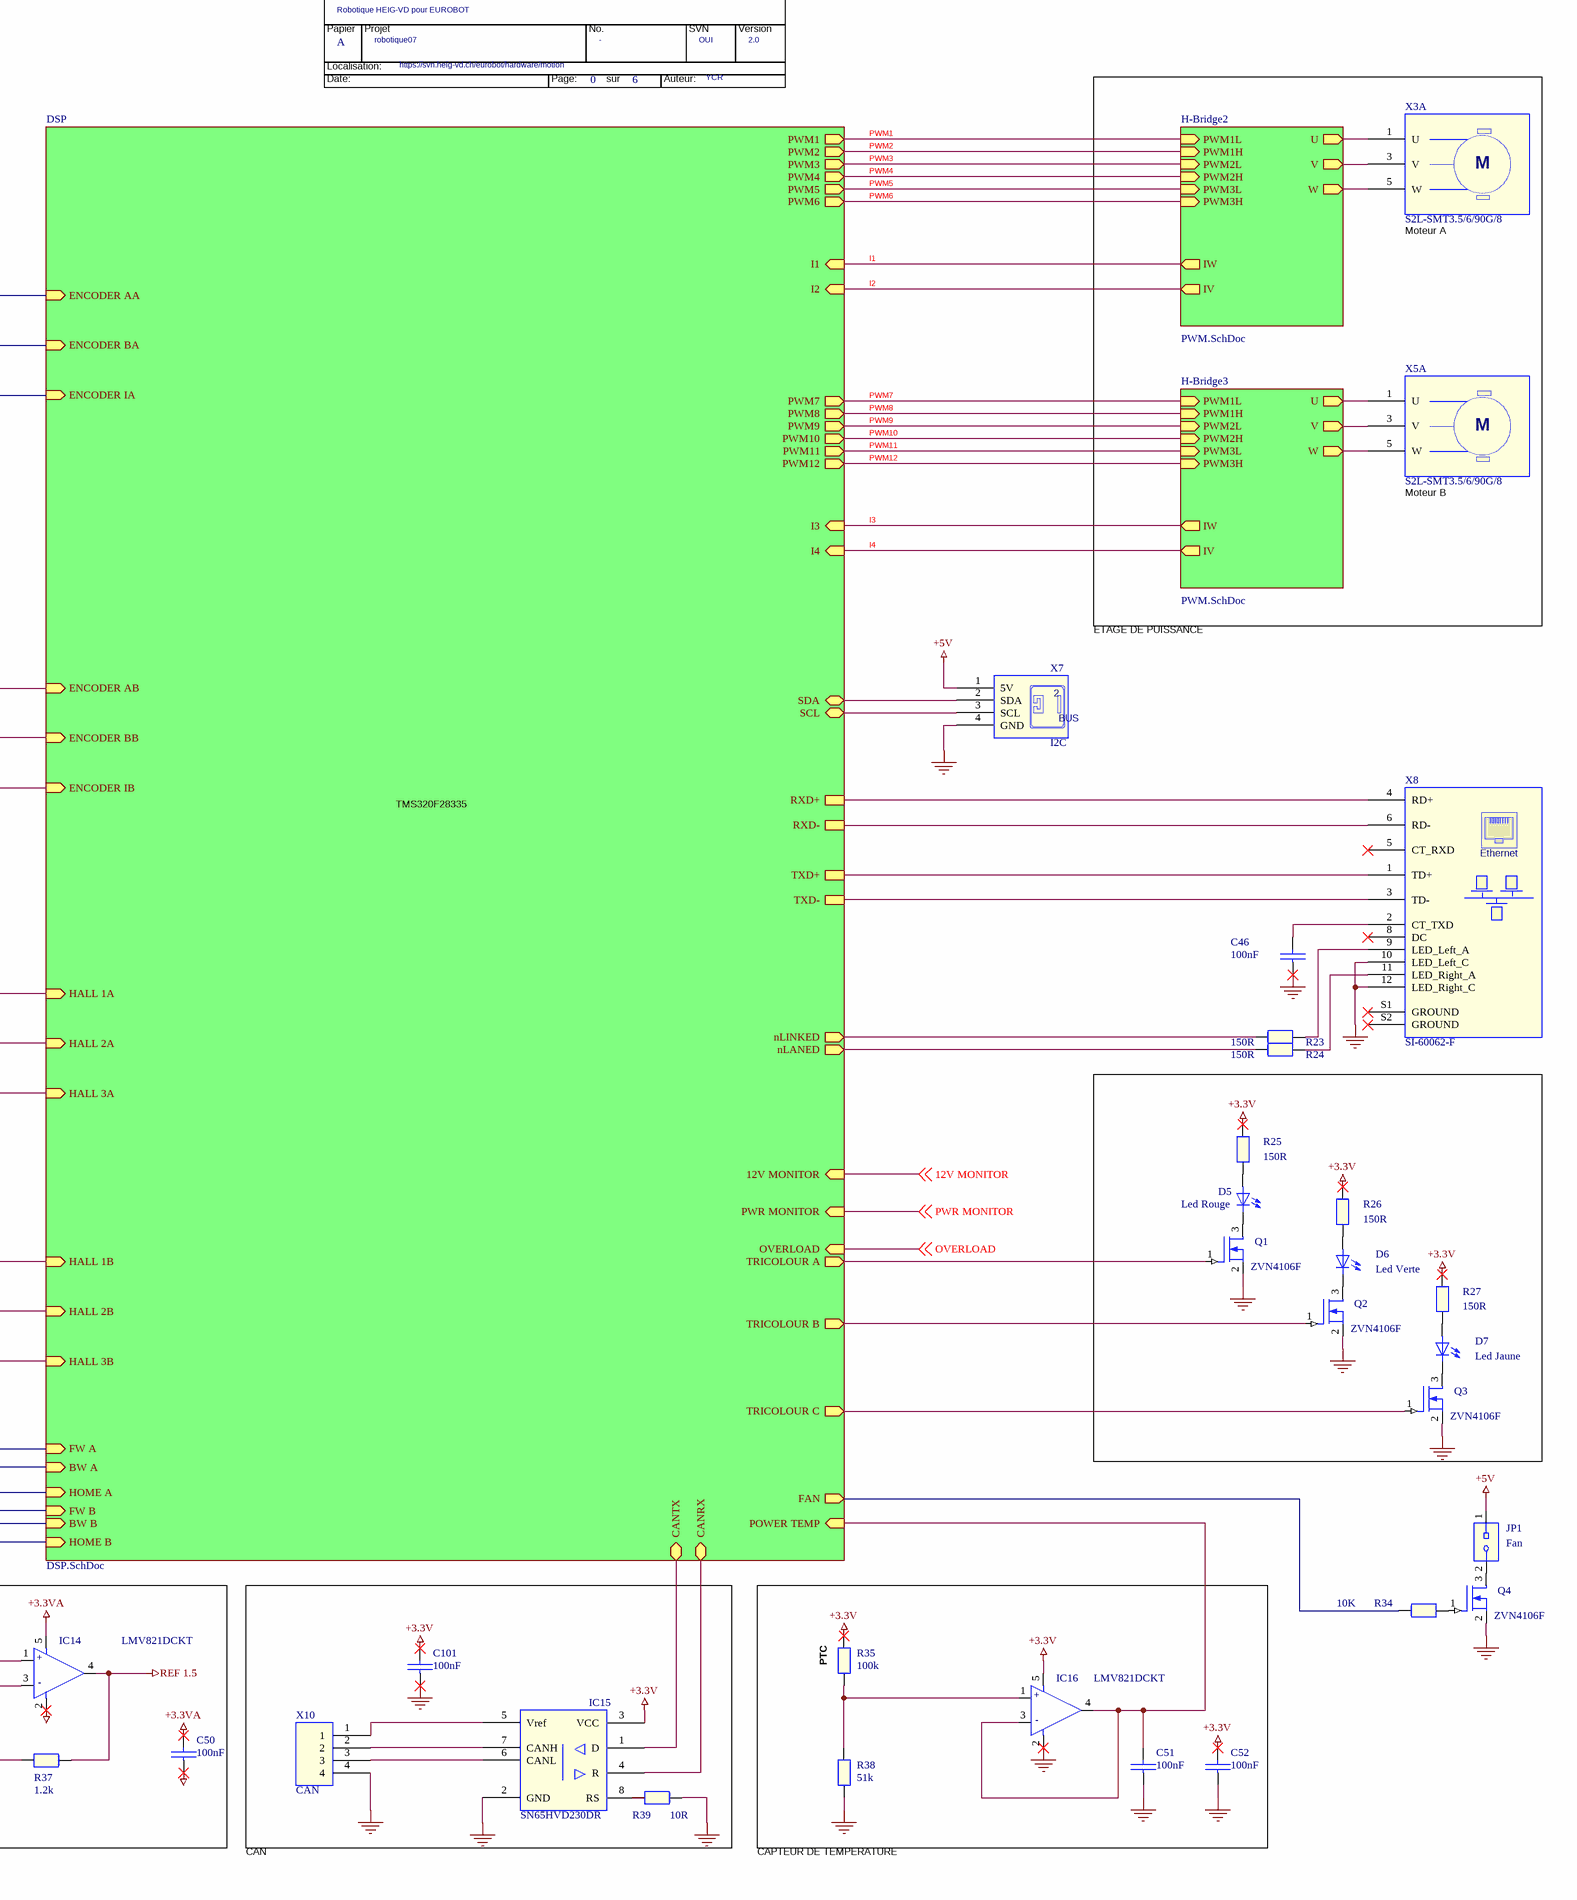
[diagram p4: Interfaces.SchDoc, bottom right]

### Parts
(Parts that share a designator on the sheet are numbered #1, #2 ... from top to bottom, then left to right.)
*  SVN: OUI  Author: YCR  Subtitle: Robotique HEIG-VD pour EUROBOT  Projet: robotique07  Page Count: 6  Page Number: 0  Page Size: A  Title: Contrôle Moteurs - DSP  RevCode: 2.0  (hidden comment: TitleBlock HEIG-VD)  (graphical)
C43  100nF  [SM/C_0805]
C44  100nF  [SM/C_0805]
C45  100nF  [SM/C_0805]
C46  100nF  [SM/C_0805]
C47  100nF  [SM/C_0805]
C48  100nF  [SM/C_0805]
C49  100nF  [SM/C_0805]
C50  100nF  [SM/C_0805]
C51  100nF  [SM/C_0805]
C52  100nF  [SM/C_0805]
C100  100nF  [SM/C_0805]
C101  100nF  [SM/C_0805]
D5  Led Rouge  [LED 5]
D6  Led Verte  [LED 5]
D7  Led Jaune  [LED 5]
IC8  AM26C32IPW  [HEIG/SM/TSSOP16]
IC9#1  SN74LVC14APWR  [SOG.65M/14/WG6.40/L5.00]  (value not drawn)  (part A of 6)
IC9#2  SN74LVC14APWR  [SOG.65M/14/WG6.40/L5.00]  (value not drawn)  (part A of 6)
IC9#3  SN74LVC14APWR  [SOG.65M/14/WG6.40/L5.00]  (part A of 6)
IC9#4  SN74LVC14APWR  [SOG.65M/14/WG6.40/L5.00]  (value not drawn)  (part A of 6)
IC9#5  SN74LVC14APWR  [SOG.65M/14/WG6.40/L5.00]  (value not drawn)  (part A of 6)
IC9#6  SN74LVC14APWR  [SOG.65M/14/WG6.40/L5.00]  (part A of 6)
IC10  AM26C32IPW  [HEIG/SM/TSSOP16]
IC11#1  SN74LVC14APWR  [SOG.65M/14/WG6.40/L5.00]  (value not drawn)  (part A of 6)
IC11#2  SN74LVC14APWR  [SOG.65M/14/WG6.40/L5.00]  (value not drawn)  (part A of 6)
IC11#3  SN74LVC14APWR  [SOG.65M/14/WG6.40/L5.00]  (part A of 6)
IC11#4  SN74LVC14APWR  [SOG.65M/14/WG6.40/L5.00]  (value not drawn)  (part A of 6)
IC11#5  SN74LVC14APWR  [SOG.65M/14/WG6.40/L5.00]  (value not drawn)  (part A of 6)
IC11#6  SN74LVC14APWR  [SOG.65M/14/WG6.40/L5.00]  (part A of 6)
IC12#1  SN74LVC14APWR  [SOG.65M/14/WG6.40/L5.00]  (value not drawn)  (part A of 6)
IC12#2  SN74LVC14APWR  [SOG.65M/14/WG6.40/L5.00]  (value not drawn)  (part A of 6)
IC12#3  SN74LVC14APWR  [SOG.65M/14/WG6.40/L5.00]  (value not drawn)  (part A of 6)
IC12#4  SN74LVC14APWR  [SOG.65M/14/WG6.40/L5.00]  (value not drawn)  (part A of 6)
IC12#5  SN74LVC14APWR  [SOG.65M/14/WG6.40/L5.00]  (value not drawn)  (part A of 6)
IC12#6  SN74LVC14APWR  [SOG.65M/14/WG6.40/L5.00]  (value not drawn)  (part A of 6)
IC13  MAX6120EUR+T  [SOT23_123]
IC14  LMV821DCKT  [HEIG/SM/SC70]
IC15  SN65HVD230DR  [SOG.050/8/WG.244/L.197]
IC16  LMV821DCKT  [HEIG/SM/SC70]
JP1  Fan  [JP2]
Q1  ZVN4106F  [SM/SOT23_123]
Q2  ZVN4106F  [SM/SOT23_123]
Q3  ZVN4106F  [SM/SOT23_123]
Q4  ZVN4106F  [SM/SOT23_123]
R23  150R  [R400]
R24  150R  [R400]
R25  150R  [R400]
R26  150R  [R400]
R27  150R  [R400]
R28  10K  [R400]
R29  10K  [R400]
R30  10K  [R400]
R31  10K  [R400]
R32  10K  [R400]
R33  10K  [R400]
R34  10K  [R400]
R35  100k  [R400]
R36  4.7k  [R400]
R37  1.2k  [R400]
R38  51k  [R400]
R39  10R  [R400]
X3  S2L-SMT3.5/6/90G/8  [Molex8]  (parts A,B of 2)
X4  S2L-SMT3.5/6/90G/8  [HEIG/CON/WDM/S2L-SMT3.5/6/90G/8]
X5  S2L-SMT3.5/6/90G/8  [Molex8]  (parts A,B of 2)
X6  S2L-SMT3.5/6/90G/8  [HEIG/CON/WDM/S2L-SMT3.5/6/90G/8]
X7  I2C  [HEIG/CONN/MICROMATCH/FEM/4]
X8  SI-60062-F  [FCC_RJ45_BLINDE_BSC_4303696]
X9  S2L-SMT3.5/6/90G/8  [HEIG/CON/WDM/S2L-SMT3.5/6/90G/8]
X10  CAN  [HEIG/MOLEX/95501-2441]

### Blocks framed on the sheet
Moteur A: C43 C44 IC8 IC9#1-IC9#3 X4
CAPTEUR EFFET HALL MOTEUR B: C100 IC12#1-IC12#6 R28-R33 X9
PTC: C51 C52 IC16 R35 R38

### Sub-sheets
DSP = DSP.SchDoc: SDA (bidir), SCL (bidir), CANRX (bidir), CANTX (bidir), PWM1 (out), PWM2 (out), PWM3 (out), PWM4 (out), PWM5 (out), PWM6 (out), PWM7 (out), PWM8 (out), PWM9 (out), PWM10 (out), PWM11 (out), PWM12 (out), I1 (in), I2 (in), I3 (in), I4 (in), HALL 1A (in), HALL 2A (in), HALL 3A (in), HALL 1B (in), HALL 2B (in), HALL 3B (in), ENCODER AA (in), ENCODER BA (in), ENCODER IA (in), ENCODER IB (in), ENCODER AB (in), ENCODER BB (in), OVERLOAD (in), TRICOLOUR A (out), TRICOLOUR B (out), TRICOLOUR C (out), FAN (out), POWER TEMP (in), FW A (in), BW A (in), HOME A (in), FW B (in), BW B (in), HOME B (in), RXD-, PWR MONITOR (in), 12V MONITOR (in), TXD+, TXD-, RXD+, nLINKED (out), nLANED (out)
H-Bridge2 = PWM.SchDoc: IV (out), PWM1H (in), PWM2H (in), PWM2L (in), PWM3H (in), PWM3L (in), PWM1L (in), IW (out), U (out), V (out), W (out)  | ReuseAnnotated: YES; R__12_PartReference: R82; IC__3_PartReference: IC29; R__PartReference: R83; R__13_PartReference: R84; R__8_PartReference: R85; C__5_PartReference: C83; R__14_PartReference: R86; D__2_PartReference: D11; Q__1_PartReference: Q11; R__15_PartReference: R87; R__9_PartReference: R88; C__8_PartReference: C85; R__16_PartReference: R89; IC__2_PartReference: IC30; IC__4_PartReference: IC29; Q__5_PartReference: Q12; Q__3_PartReference: Q13; Q__PartReference: Q14; R__4_PartReference: R90; R__22_PartReference: R91; R__10_PartReference: R92; R__20_PartReference: R93; IC__PartReference: IC31; R__17_PartReference: R94; R__1_PartReference: R95; Q__4_PartReference: Q15; R__5_PartReference: R96; C__3_PartReference: C86; R__6_PartReference: R97; C__9_PartReference: C87; C__PartReference: C88; R__18_PartReference: R98; IC__5_PartReference: IC32; Q__2_PartReference: Q16; D__1_PartReference: D12; C__6_PartReference: C89; C__10_PartReference: C90; R__2_PartReference: R99; C__1_PartReference: C91; R__21_PartReference: R100; C__2_PartReference: C92; R__11_PartReference: R101; C__4_PartReference: C93; D__PartReference: D13; IC__1_PartReference: IC33; R__7_PartReference: R102; R__19_PartReference: R103; C__11_PartReference: C94; C__7_PartReference: C95; R__3_PartReference: R104; TitleBlock_Page_Number: 0
H-Bridge3 = PWM.SchDoc: IV (out), PWM1H (in), PWM2H (in), PWM2L (in), PWM3H (in), PWM3L (in), PWM1L (in), IW (out), U (out), V (out), W (out)  | ReuseAnnotated: YES; R__12_PartReference: R59; IC__3_PartReference: IC24; R__PartReference: R60; R__13_PartReference: R61; R__8_PartReference: R62; C__5_PartReference: C70; R__14_PartReference: R63; D__2_PartReference: D8; Q__1_PartReference: Q5; R__15_PartReference: R64; R__9_PartReference: R65; C__8_PartReference: C72; R__16_PartReference: R66; IC__2_PartReference: IC25; IC__4_PartReference: IC24; Q__5_PartReference: Q6; Q__3_PartReference: Q7; Q__PartReference: Q8; R__4_PartReference: R67; R__22_PartReference: R68; R__10_PartReference: R69; R__20_PartReference: R70; IC__PartReference: IC26; R__17_PartReference: R71; R__1_PartReference: R72; Q__4_PartReference: Q9; R__5_PartReference: R73; C__3_PartReference: C73; R__6_PartReference: R74; C__9_PartReference: C74; C__PartReference: C75; R__18_PartReference: R75; IC__5_PartReference: IC27; Q__2_PartReference: Q10; D__1_PartReference: D9; C__6_PartReference: C76; C__10_PartReference: C77; R__2_PartReference: R76; C__1_PartReference: C78; R__21_PartReference: R77; C__2_PartReference: C79; R__11_PartReference: R78; C__4_PartReference: C80; D__PartReference: D10; IC__1_PartReference: IC28; R__7_PartReference: R79; R__19_PartReference: R80; C__11_PartReference: C81; C__7_PartReference: C82; R__3_PartReference: R81; TitleBlock_Page_Number: 1

### Nets
+3.3V: C44.1 C47.1 C52.1 C100.1 C101.1 IC9#1.14(VCC) IC9#2.14(VCC) IC9#3.14(VCC) IC9#4.14(VCC) IC9#5.14(VCC) IC9#6.14(VCC) IC11#1.14(VCC) IC11#2.14(VCC) IC11#3.14(VCC) IC11#4.14(VCC) IC11#5.14(VCC) IC11#6.14(VCC) IC12#1.14(VCC) IC12#2.14(VCC) IC12#3.14(VCC) IC12#4.14(VCC) IC12#5.14(VCC) IC12#6.14(VCC) IC15.3(VCC) IC16.5(VCC) R25.1 R26.1 R27.1 R35.2  [also labelled VCC]
+3.3VA: C48.1 C50.1 IC13.1(VIN) IC14.5(VCC)
+5V: C43.1 C45.1 IC8.4(CTRL) IC8.16(VCC) IC10.4(CTRL) IC10.16(VCC) JP1.1 R28.2 R29.2 R30.2 R31.2 R32.2 R33.2 X3.7(VCC) X4.1 X5.7(VCC) X6.1 X7.1(5V)
AGND: C48.2 C49.2 C50.2 IC13.3(GND) IC14.2(GND) R36.1
GND: C43.2 C44.2 C45.2 C46.2 C47.2 C51.2 C52.2 C100.2 C101.2 IC8.8(GND) IC8.12(~{CTRL}) IC9#1.7(GND) IC9#2.7(GND) IC9#3.7(GND) IC9#4.7(GND) IC9#5.7(GND) IC9#6.7(GND) IC10.8(GND) IC10.12(~{CTRL}) IC11#1.7(GND) IC11#2.7(GND) IC11#3.7(GND) IC11#4.7(GND) IC11#5.7(GND) IC11#6.7(GND) IC12#1.7(GND) IC12#2.7(GND) IC12#3.7(GND) IC12#4.7(GND) IC12#5.7(GND) IC12#6.7(GND) IC15.2(GND) IC16.2(GND) Q1.2(SOURCE) Q2.2(SOURCE) Q3.2(SOURCE) Q4.2(SOURCE) R38.1 R39.1 X3.8(GND) X4.2 X5.8(GND) X6.2 X7.4(GND) X8.10(LED_Left_C) X8.12(LED_Right_C) X9.7 X9.8 X10.4
REF 1.5: IC14.4(out) R37.1
12V MONITOR: off-sheet 12V MONITOR, sheet DSP/12V MONITOR
HALL1: IC11#1.2(6Y) ; sheet DSP/HALL 1A  [project net HALL0]
HALL2: IC11#2.2(6Y) ; sheet DSP/HALL 2A  [project net HALL1]
HALL3: IC11#3.2(6Y) ; sheet DSP/HALL 3A  [project net HALL2]
HALL4: IC11#4.2(6Y) ; sheet DSP/HALL 1B  [project net HALL3]
HALL5: IC11#5.2(6Y) ; sheet DSP/HALL 2B  [project net HALL4]
HALL6: IC11#6.2(6Y) ; sheet DSP/HALL 3B  [project net HALL5]
I1: sheet DSP/I1, sheet H-Bridge2/IW
I2: sheet DSP/I2, sheet H-Bridge2/IV
I3: sheet DSP/I3, sheet H-Bridge3/IW
I4: sheet DSP/I4, sheet H-Bridge3/IV
IO0: Q1.1(GATE) ; sheet DSP/TRICOLOUR A
IO1: Q2.1(GATE) ; sheet DSP/TRICOLOUR B
IO2: Q3.1(GATE) ; sheet DSP/TRICOLOUR C
IO3: IC12#1.2(6Y) ; sheet DSP/FW A
IO4: IC12#2.2(6Y) ; sheet DSP/BW A
IO5: IC12#3.2(6Y) ; sheet DSP/HOME A
IO6: IC12#4.2(6Y) ; sheet DSP/FW B
IO7: IC12#5.2(6Y) ; sheet DSP/BW B
IO8: IC12#6.2(6Y) ; sheet DSP/HOME B
OVERLOAD: off-sheet OVERLOAD, sheet DSP/OVERLOAD
PWM1: sheet DSP/PWM1, sheet H-Bridge2/PWM1L
PWM1_RO: X5.1(U) ; sheet H-Bridge3/U
PWM1_RO: X3.1(U) ; sheet H-Bridge2/U  [a separate net that carries the same name]
PWM2: sheet DSP/PWM2, sheet H-Bridge2/PWM1H
PWM2_RO: X5.3(V) ; sheet H-Bridge3/V
PWM2_RO: X3.3(V) ; sheet H-Bridge2/V  [a separate net that carries the same name]
PWM3: sheet DSP/PWM3, sheet H-Bridge2/PWM2L
PWM3_RO: X5.5(W) ; sheet H-Bridge3/W
PWM3_RO: X3.5(W) ; sheet H-Bridge2/W  [a separate net that carries the same name]
PWM4: sheet DSP/PWM4, sheet H-Bridge2/PWM2H
PWM5: sheet DSP/PWM5, sheet H-Bridge2/PWM3L
PWM6: sheet DSP/PWM6, sheet H-Bridge2/PWM3H
PWM7: sheet DSP/PWM7, sheet H-Bridge3/PWM1L
PWM8: sheet DSP/PWM8, sheet H-Bridge3/PWM1H
PWM9: sheet DSP/PWM9, sheet H-Bridge3/PWM2L
PWM10: sheet DSP/PWM10, sheet H-Bridge3/PWM2H
PWM11: sheet DSP/PWM11, sheet H-Bridge3/PWM3L
PWM12: sheet DSP/PWM12, sheet H-Bridge3/PWM3H
PWR MONITOR: off-sheet PWR MONITOR, sheet DSP/PWR MONITOR
NetC46_1: C46.1 X8.2(CT_TXD)
NetC49_1: C49.1 IC13.2(VOUT) IC14.1(IN+)
NetC51_1: C51.1 IC16.3(IN-) IC16.4(out) ; sheet DSP/POWER TEMP
NetC57_1: X8.3(TD-) ; sheet DSP/TXD-
NetC57_2: X8.1(TD+) ; sheet DSP/TXD+
NetD5_1: D5.1 Q1.3(DRAIN)
NetD5_2: D5.2 R25.2
NetD6_1: D6.1 Q2.3(DRAIN)
NetD6_2: D6.2 R26.2
NetD7_1: D7.1 Q3.3(DRAIN)
NetD7_2: D7.2 R27.2
NetIC6_H2: R34.1 ; sheet DSP/FAN
NetIC6_K7: IC15.1(D) ; sheet DSP/CANTX
NetIC6_K8: IC9#6.2(6Y) ; sheet DSP/ENCODER IB
NetIC6_L6: IC15.4(R) ; sheet DSP/CANRX
NetIC6_L7: IC9#1.2(6Y) ; sheet DSP/ENCODER AA
NetIC6_M7: IC9#3.2(6Y) ; sheet DSP/ENCODER IA
NetIC6_M8: IC9#4.2(6Y) ; sheet DSP/ENCODER AB
NetIC6_N8: IC9#5.2(6Y) ; sheet DSP/ENCODER BB
NetIC6_N9: X7.2(SDA) ; sheet DSP/SDA
NetIC6_P7: IC9#2.2(6Y) ; sheet DSP/ENCODER BA
NetIC6_P9: X7.3(SCL) ; sheet DSP/SCL
NetIC8_1: IC8.1(AIN-) X4.4
NetIC8_2: IC8.2(AIN+) X4.3
NetIC8_3: IC8.3(AOUT) IC9#1.1(6A)
NetIC8_5: IC8.5(COUT) IC9#3.1(6A)
NetIC8_6: IC8.6(CIN+) X4.7
NetIC8_7: IC8.7(CIN-) X4.8
NetIC8_13: IC8.13(BOUT) IC9#2.1(6A)
NetIC8_14: IC8.14(BIN+) X4.5
NetIC8_15: IC8.15(BIN-) X4.6
NetIC9#4_1: IC9#4.1(6A) IC10.3(AOUT)
NetIC9#5_1: IC9#5.1(6A) IC10.13(BOUT)
NetIC9#6_1: IC9#6.1(6A) IC10.5(COUT)
NetIC10_1: IC10.1(AIN-) X6.4
NetIC10_2: IC10.2(AIN+) X6.3
NetIC10_6: IC10.6(CIN+) X6.7
NetIC10_7: IC10.7(CIN-) X6.8
NetIC10_14: IC10.14(BIN+) X6.5
NetIC10_15: IC10.15(BIN-) X6.6
NetIC11#1_1: IC11#1.1(6A) X3.2(Hall_A)
NetIC11#2_1: IC11#2.1(6A) X3.4(Hall_B)
NetIC11#3_1: IC11#3.1(6A) X3.6(Hall_C)
NetIC11#4_1: IC11#4.1(6A) X5.2(Hall_A)
NetIC11#5_1: IC11#5.1(6A) X5.4(Hall_B)
NetIC11#6_1: IC11#6.1(6A) X5.6(Hall_C)
NetIC12#1_1: IC12#1.1(6A) R33.1 X9.1
NetIC12#2_1: IC12#2.1(6A) R32.1 X9.2
NetIC12#3_1: IC12#3.1(6A) R31.1 X9.3
NetIC12#4_1: IC12#4.1(6A) R30.1 X9.4
NetIC12#5_1: IC12#5.1(6A) R29.1 X9.5
NetIC12#6_1: IC12#6.1(6A) R28.1 X9.6
NetIC14_3: IC14.3(IN-) R36.2 R37.2
NetIC15_5: IC15.5(Vref) X10.1
NetIC15_6: IC15.6(CANL) X10.3
NetIC15_7: IC15.7(CANH) X10.2
NetIC15_8: IC15.8(RS) R39.2
NetIC16_1: IC16.1(IN+) R35.1 R38.2
NetIC18_91: X8.4(RD+) ; sheet DSP/RXD+
NetIC18_92: X8.6(RD-) ; sheet DSP/RXD-
NetIC18_99: R23.1 ; sheet DSP/nLINKED
NetIC18_100: R24.1 ; sheet DSP/nLANED
NetJP1_2: JP1.2 Q4.3(DRAIN)
NetQ4_1: Q4.1(GATE) R34.2
NetR23_2: R23.2 X8.9(LED_Left_A)
NetR24_2: R24.2 X8.11(LED_Right_A)

Not connected (* = marked no-connect by the designer): IC8 9(DIN-)* 10(DIN+)* 11(DOUT)*; IC10 9(DIN-)* 10(DIN+)* 11(DOUT)*; X8 5(CT_RXD)* 8(DC)* S1(GROUND)* S2(GROUND)*

### Notes on the sheet
- (near X3) Moteur A
- (near X5) Moteur B
- CAPTEUR TTL A
- ETAGE DE PUISSANCE
- (near X6) Moteur B
- TMS320F28335
- CAPTEUR TTL
- Moteur A
- CAPTEUR EFFET HALL MOTEUR A
- Moteur B
- FIN DE COURSES
- REFERENCES DE TENSION
- CAN
- CAPTEUR DE TEMPERATURE
- Title
- HES-SO / HEIG-VD / TIN / IAI
  Route de Cheseaux, 1
  CH-1401 Yverdon-les-Bains
  T +41 24 557 73 77    F +41 24 557 63 20
  http://iai.heig-vd.ch
  iai@heig-vd.ch
- Size
- Date
- File
- A4
- Project
- Sheet
- of
- No.
- Author
- SVN/Git
- Version
- (in symbol Connecteur Moteur_2, part A) M
- (in symbol Connecteur Moteur_2, part B) B; A; C
- (in symbol I2C) BUS
- (in symbol LMV821DCKT_1) +; -
- (in symbol LU1T041-43_3) Ethernet
- (in symbol TitleBlock HEIG-VD) Ecole d'Ingénierie et de Gestion du Canton de Vaud; rte de Cheseaux, 1; CH-1401 Yverdon-les-Bains; T +41(0)24 55 76 330; F +41(0)24 55 76 320; U http://www.heig-vd.ch; M iai@heig-vd.ch; Titre; Papier; Projet; No.; SVN; Version; Localisation:; Date:; Page:; sur; Auteur:

### Library data of the parts
* = TitleBlock HEIG-VD: OrgName: Institut d'automatisation Industrielle; OrgAddr3: 1400 Yverdon-les-Bains; Location: https://svn.heig-vd.ch/eurobot/hardware/motion; No Projet: -; Page Create Date: March  8, 1995
C43 C44 C51 = C_Dup1: Quantité min: 10; Fabricant: PHYCOMP; Ref. Fabricant: 2238 786 15649; Prix: 0.06; Ref. Fab: AVX; PCB Footprint: HEIG/SM/C_0603; Distributeur: Farnell; Ref. Distributeur: 432210; Distributor: Farnell; Price in €: 0.140; Ref. Distributor: 499-687
C45 C52 = C_Dup1: Quantité min: 10; Fabricant: PHYCOMP; Ref. Fab: AVX; Prix: 0.06; Ref. Fabricant: 2238 786 15649; PCB Footprint: HEIG/SM/C_0603; Ref. Distributor: 499-687; Price in €: 0.140; Distributor: Farnell; Ref. Distributeur: 432210; Distributeur: Farnell
C46 = C: Quantité min: 10; Ref. Fabricant: 2238 786 15649; Fabricant: PHYCOMP; Prix: 0.06; PCB Footprint: HEIG/SM/C_0805; Ref. Distributeur: 432210; Distributeur: Farnell
C47-C49 = C_Dup1: Ref. Fabricant: 2238 786 15649; Prix: 0.06; Ref. Fab: AVX; Fabricant: PHYCOMP; Quantité min: 10; PCB Footprint: HEIG/SM/C_0603; Distributeur: Farnell; Ref. Distributeur: 432210; Distributor: Farnell; Price in €: 0.140; Ref. Distributor: 499-687
C50 = C_Dup1: Ref. Fab: AVX; Prix: 0.06; Ref. Fabricant: 2238 786 15649; Fabricant: PHYCOMP; Quantité min: 10; PCB Footprint: HEIG/SM/C_0603; Ref. Distributor: 499-687; Price in €: 0.140; Distributor: Farnell; Ref. Distributeur: 432210; Distributeur: Farnell
C100 C101 = C_Dup1: PCB Footprint: HEIG/SM/C_0603; Ref. Fabricant: 2238 786 15649; Prix: 0.06; Ref. Fab: AVX; Fabricant: PHYCOMP; Quantité min: 10; Distributeur: Farnell; Ref. Distributeur: 432210; Distributor: Farnell; Price in €: 0.140; Ref. Distributor: 499-687
D5 = Led_0: Quantité min: 1; Fabricant: VISHAY; PCB Footprint: PLCC_2; Ref. Fab: QTLP670C-2... FAIRCHILD SEMICONDUCTOR; Ref. Fabricant: TLMT3100-GS08; Prix: 0.49; Distributor: Farnell; Ref. Distributor: 3599917; Price in €: 0.144; Ref. Distributeur: 1045493; Distributeur: Farnell
D6 = Led_0: Quantité min: 1; Fabricant: VISHAY; PCB Footprint: PLCC_2; Ref. Fab: QTLP670C-2... FAIRCHILD SEMICONDUCTOR; Ref. Fabricant: TLMC3100-GS08; Prix: 0.408; Distributor: Farnell; Ref. Distributor: 3599917; Price in €: 0.144; Ref. Distributeur: 1213159; Distributeur: Farnell
D7 = Led_0: Quantité min: 1; Fabricant: VISHAY; PCB Footprint: PLCC_2; Ref. Fab: QTLP670C-2... FAIRCHILD SEMICONDUCTOR; Prix: 0.15; Ref. Fabricant: TLMA3100-GS08.; Distributor: Farnell; Ref. Distributor: 3599917; Price in €: 0.144; Ref. Distributeur: 8311242; Distributeur: Farnell
IC8 IC10 = AM26LS32_2: Prix: 1.50; Fabricant: TEXAS INSTRUMENTS; Quantité min: 1; Ref. Distributor: 1103045; Ref. Distributeur: AM26C32IPW; Distributeur: TEXAS INSTRUMENTS; Ref. Fabricant: AM26C32IPW; PCB Footprint: HEIG/SM/TSSOP16
IC9#1-IC9#6 IC11#1-IC11#6 = 7414: Quantité min: 1; Fabricant: TEXAS INSTRUMENTS; Prix: 0.968; PCB Footprint: SOG.65M/14/WG6.40/L5.00; Ref. Distributeur: 1102979; Ref. Fabricant: SN74LVC14APWR; Distributeur: Farnell; Distributor: Spoerle
IC12#1-IC12#6 = 7414: Prix: 0.968; Fabricant: TEXAS INSTRUMENTS; Quantité min: 1; PCB Footprint: SOG.65M/14/WG6.40/L5.00; Distributor: Spoerle; Distributeur: Farnell; Ref. Fabricant: SN74LVC14APWR; Ref. Distributeur: 1102979
IC13 = MAX6120: PCB Footprint: HEIG/SM/SOT23; Prix: 4.65; Fabricant: MAXIM; Quantité min: 1; Ref. Fabricant: MAX6120EUR+T; Ref. Distributeur: 1188066; Distributeur: Farnell
IC14 IC16 = LMV821DCKT_1: Ref. Fabricant: LMV821IDCKTE4; Fabricant: TEXAS INSTRUMENTS; Prix: 1.45; PCB Footprint: HEIG/SM/SC70; Ref. Distributeur: 1053752; Distributeur: Farnell
IC15 = SN65HVD230_1: Prix: 6.05; Fabricant: TEXAS INSTRUMENTS; Quantité min: 1; PCB Footprint: SOG.050/8/WG.244/L.197; Distributeur: Farnell; Ref. Distributeur: 8452148; Ref. Fabricant: SN65HVD230DR
JP1 = Jumpers 1x: PCB Footprint: CON_002; Prix: 0; Ref. Fab: 75160-101-36 FCI; Ref. Fabricant: -; Ref. Distributeur: -; Distributeur: -; Price in €: 3.94; Ref. Distributor: 528419; Distributor: Farnell
Q1-Q3 = MOSFET N_0: MEMORY: NO; Prix: 1.25; Fabricant: ZETEX; Quantité min: 5; Ref. Distributeur: 9526250; Ref. Fabricant: ZVN4106F; Distributeur: Farnell; PCB Footprint: SM/SOT23_123
Q4 = MOSFET N_0: Prix: 1.25; MEMORY: NO; Fabricant: ZETEX; Quantité min: 5; Distributeur: Farnell; Ref. Fabricant: ZVN4106F; Ref. Distributeur: 9526250; PCB Footprint: SM/SOT23_123
R23 R24 = R_Dup1: PCB Footprint: HEIG/SM/R_0603; Prix: 0.064; Fabricant: MC 0.063W 0603 5% 150R; Ref. Fabricant: MULTICOMP; Quantité min: 50; Distributeur: Farnell; Ref. Distributeur: 9331794
R25-R27 = R_Dup1: PCB Footprint: HEIG/SM/R_0603; Quantité min: 50; Fabricant: MC 0.063W 0603 5% 150R; Ref. Fabricant: MULTICOMP; Prix: 0.064; Tolerance: 0.1%; Ref. Distributeur: 9331794; Distributeur: Farnell; Distributor: Farnell; Ref. Fab: multicomp; Price in €: 0.037; Ref. Distributor: 613-587
R28-R33 = R_Dup1: PCB Footprint: HEIG/SM/R_0603; Quantité min: 50; Fabricant: MULTICOMP; Ref. Fabricant: MC 0.063W 0603 5% 150R; Prix: 0.064; Tolerance: 0.1%; Ref. Distributeur: 9331794; Distributeur: Farnell; Distributor: Farnell; Ref. Fab: multicomp; Price in €: 0.037; Ref. Distributor: 613-587
R34 = R_Dup1: PCB Footprint: HEIG/SM/R_0603; Tolerance: 0.1%; Ref. Fab: multicomp; Prix: 0.064; Ref. Fabricant: MC 0.063W 0603 5% 150R; Quantité min: 50; Ref. Distributor: 613-587; Price in €: 0.037; Distributor: Farnell; Distributeur: Farnell; Ref. Distributeur: 9331794; Fabricant: MULTICOMP
R35 = R_Dup1: Quantité min: 1; Fabricant: VISHAY BC COMPONENTS; PCB Footprint: PTC_POWER; Ref. Fabricant: 238164054104; Prix: 2.55; Distributeur: Farnell; Ref. Distributeur: 1187037
R36 = R_Dup1: Prix: 0.064; Ref. Fabricant: MC 0.063W 0603 5% 4K7; Fabricant: MULTICOMP; Quantité min: 50; PCB Footprint: HEIG/SM/R_0603; Ref. Distributeur: 9332154; Distributeur: Farnell
R37 = R_Dup1: Prix: 0.064; Ref. Fabricant: MC 0.063W 0603 5% 1K2; Fabricant: MULTICOMP; Quantité min: 50; PCB Footprint: HEIG/SM/R_0603; Ref. Distributeur: 9331751; Distributeur: Farnell
R38 = R_Dup1: Tolérance: 1%; Prix: 0.064; Ref. Fabricant: MC 0.1W 0805 1% 51K; Fabricant: MULTICOMP; Quantité min: 50; PCB Footprint: SM/C_0805; Ref. Distributeur: 9333339; Distributeur: Farnell
R39 = R_Dup1: PCB Footprint: HEIG/SM/R_0603; Quantité min: 50; Fabricant: MULTICOMP; Tolerance: 0.1%; Prix: 0.064; Ref. Fabricant: MC 0.125W 1206 5% 10R; Distributeur: Farnell; Ref. Distributeur: 9336982
X3 X5 = Connecteur Moteur_2: Ref. Fab: 43045-0800; Prix: 5.27; Fabricant: Weidmüller; Quantité min: 1; PCB Footprint: HEIG/CON/WDM/S2L-SMT3.5/6/90G/8; Ref. Distributor: 43045-0800; Distributor: Farnell; Price in €: 1012254; Distributeur: Distrelec; Ref. Distributeur: 141637; Ref. Fabricant: S2L-SMT3.5/6/90G/8
X4 = Connecteur 08: Fabricant: Weidmüller; Prix: 5.27; Quantité min: 1; Distributeur: Distrelec; Ref. Distributeur: 141637; Ref. Fabricant: S2L-SMT3.5/6/90G/8; PCB Footprint: HEIG/CON/WDM/S2L-SMT3.5/6/90G/8
X6 X9 = Connecteur 08: Quantité min: 1; Prix: 5.27; Fabricant: Weidmüller; Ref. Fabricant: S2L-SMT3.5/6/90G/8; Ref. Distributeur: 141637; Distributeur: Distrelec; PCB Footprint: HEIG/CON/WDM/S2L-SMT3.5/6/90G/8
X7 = I2C: Quantité min: 10; Fabricant: TYCO ELECTRONICS / AMP; Ref. Fabricant: 7-215079-4; Prix: 0.44; Distributeur: Farnell; Ref. Distributeur: 148507; PCB Footprint: HEIG/CONN/MICROMATCH/FEM/4
X8 = LU1T041-43_3: Quantité min: 1; Prix: 10.15; Fabricant: STEWART CONNECTOR; Ref. Fabricant: SI-60062-F; Ref. Distributeur: 1137983; Distributeur: Farnell; PCB Footprint: FCC_RJ45_BLINDE_BSC_4303696
X10 = Connecteur 04: Quantité min: 1; Fabricant: MOLEX; Prix: 2; Ref. Fabricant: 95501-2441; Distributeur: Farnell; Ref. Distributeur: 1560167; PCB Footprint: HEIG/MOLEX/95501-2441